# EAGLE design cyclops_r3 (EAGLE 6.5.0)
Cyclops 3.0 Schematic Cyclops R3.0 High power LED driver Linear current control Optional linear optical power control Built-in DAC Wide bandwidth Appropriate for scientific applications: e.g. fluorescent imaging and optogenetics
DESIGNER: JONATHAN P. NEWMAN; DOC_NUMBER: N/A; REVISION: 3.1

## Sheet 1 of 4: I/O Interface
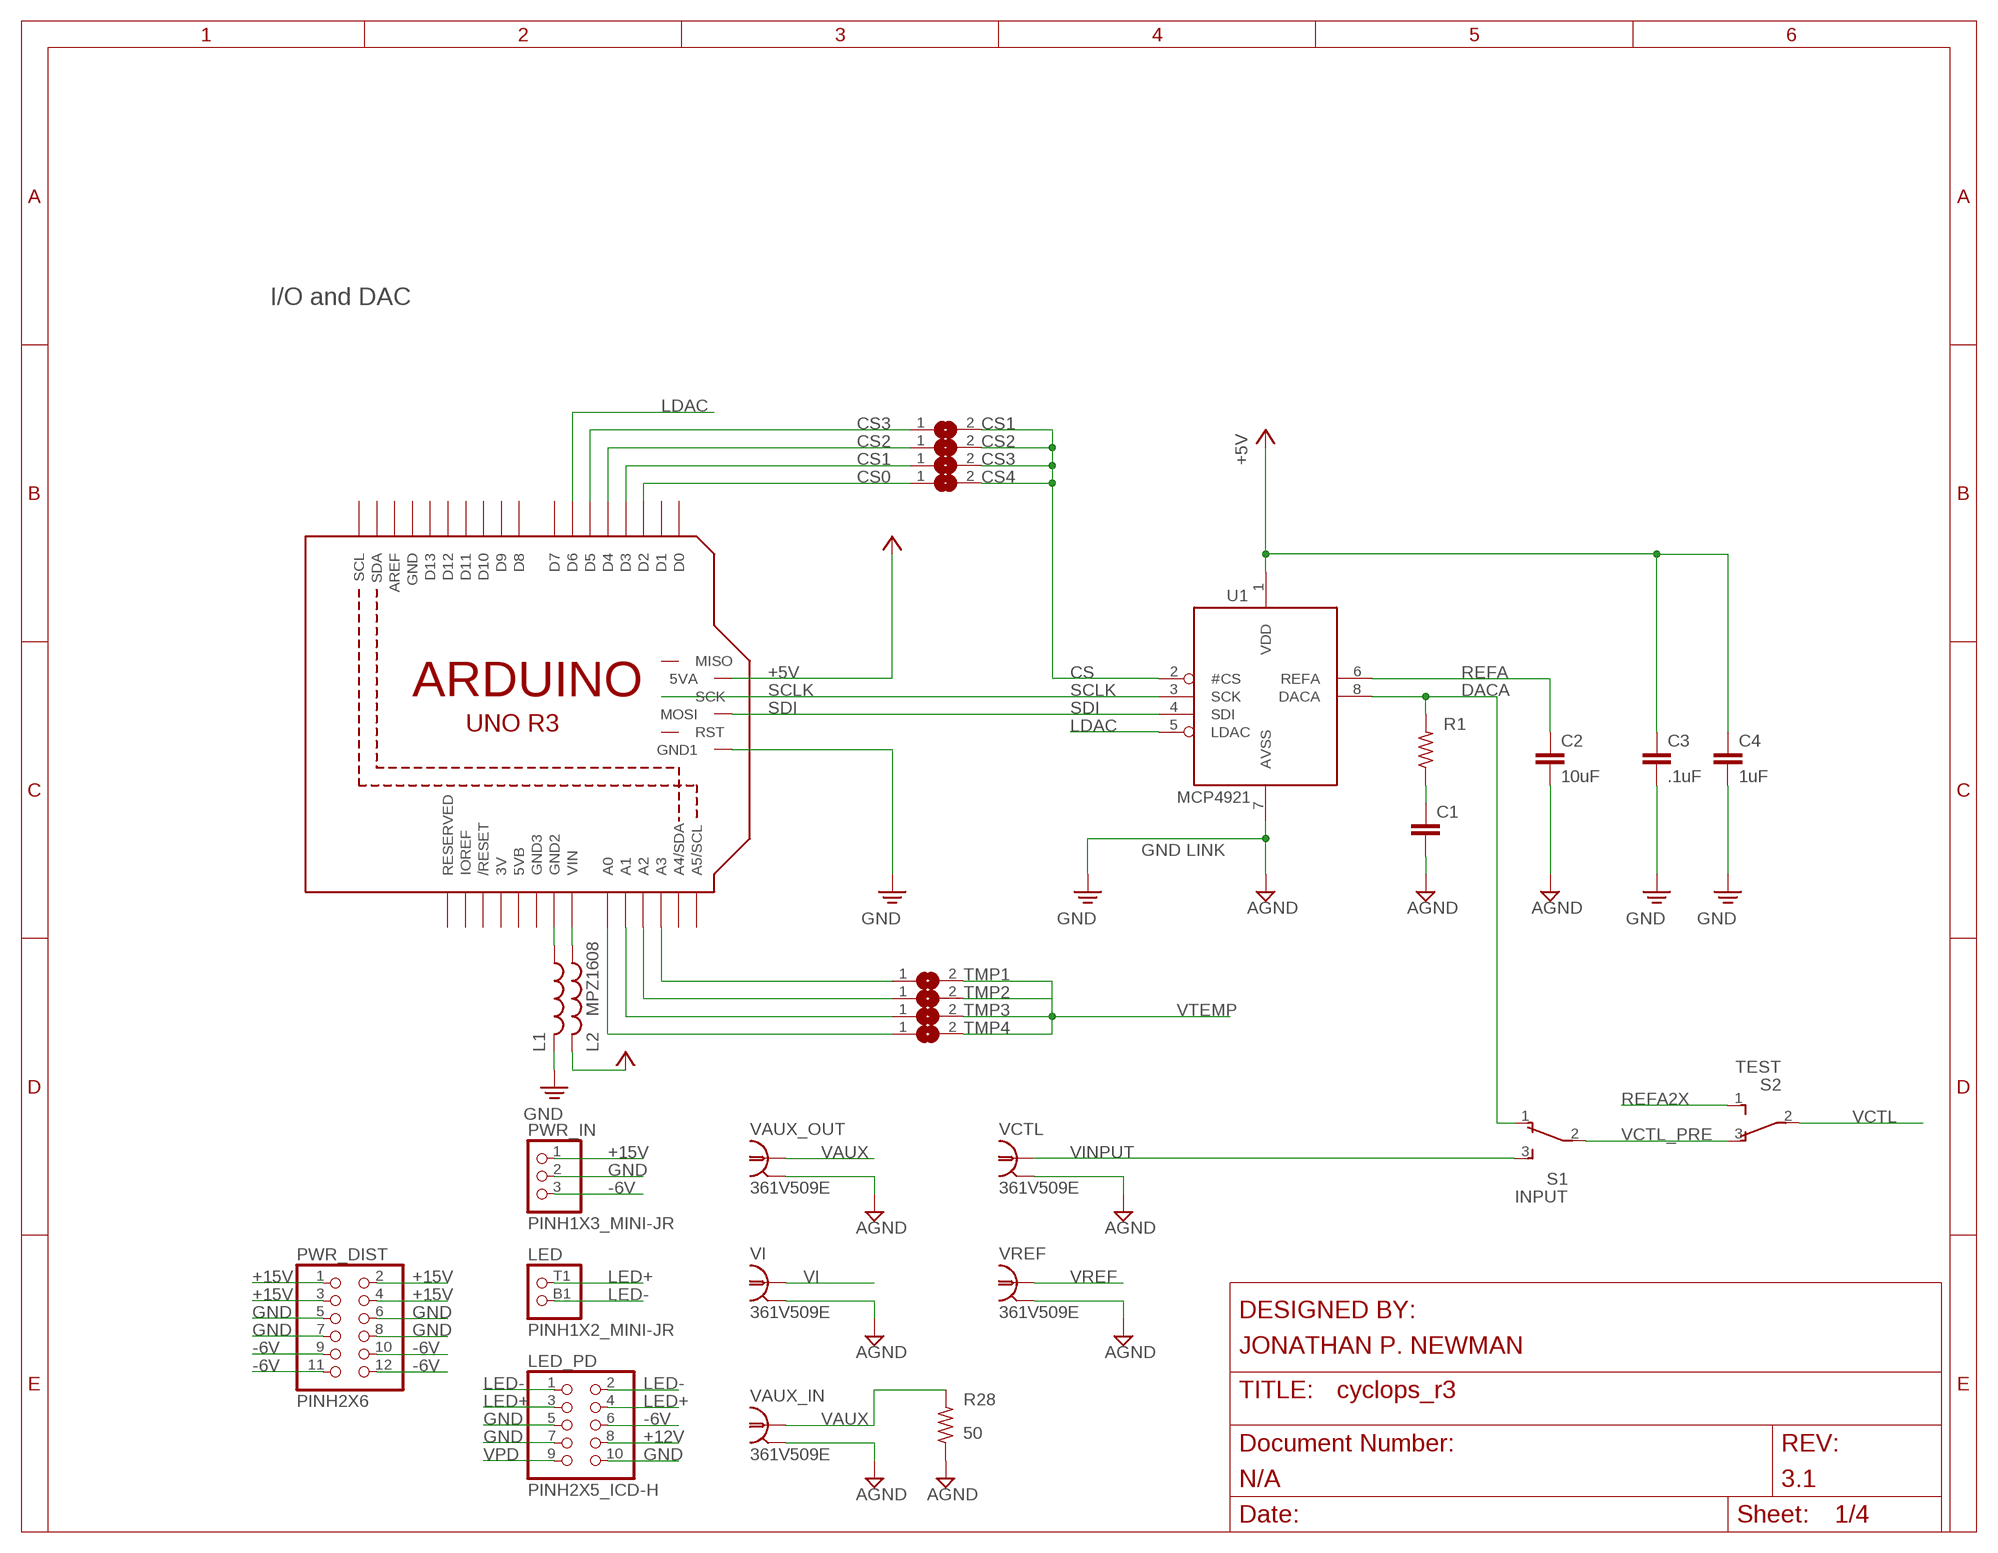
[diagram p0: schematic, sheet 1]

### Parts
ARDUNIO  ARDUINO_R3_ICSP_PINS  [ARUDINOR3_PINS]
C1  C_0603  [0603]
C2  10uF  C_0805  [0805]
C3  .1uF  C_0603  [0603]
C4  1uF  C_0805  [0805]
CS1  SJ  [SJ]
CS2  SJ  [SJ]
CS3  SJ  [SJ]
CS4  SJ  [SJ]
L1  MPZ1608  L_0805  [0805]
L2  MPZ1608  L_0805  [0805]
LED  PINH1X2_MINI-JR  [MINI-JR-2X1]
LED_PD  PINH2X5_ICD-H  [2X05-IDC]
PWR_DIST  PINH2X6  [2X06-BIG]
PWR_IN  PINH1X3_MINI-JR  [MINI-JR-1X3]
R1  R_0603  [0603]
R28  50  R_0603  [0603]
S1  INPUT  SPDT_JS  [JS102011SAQN]
S2  TEST  SPDT_CFPA  [CFPA]
TMP1  SJ  [SJ]
TMP2  SJ  [SJ]
TMP3  SJ  [SJ]
TMP4  SJ  [SJ]
U1  MCP4921  MCP4921SOIC  [SO08]
VAUX_IN  361V509E  BNC_V-BITE  [361V509E]
VAUX_OUT  361V509E  BNC_V-BITE  [361V509E]
VCTL  361V509E  BNC_V-BITE  [361V509E]
VI  361V509E  BNC_V-BITE  [361V509E]
VREF  361V509E  BNC_V-BITE  [361V509E]

### Nets
+5V: ARDUNIO.5VA C3.1 C4.1 U1.1(VDD)
+12V [pwr]: L2.2 LED_PD.8 ; supply symbol labelled +5V ; also sheet 2,3,4
+15V [pwr]: PWR_DIST.1 PWR_DIST.2 PWR_DIST.3 PWR_DIST.4 PWR_IN.1 ; also sheet 2
-6V: LED_PD.6 PWR_DIST.9 PWR_DIST.10 PWR_DIST.11 PWR_DIST.12 PWR_IN.3 ; also sheet 2
AGND: R28.1
CS: CS1.2 CS2.2 CS3.2 CS4.2 U1.2(#CS)
CS0: ARDUNIO.D2 CS4.1
CS1: ARDUNIO.D3 CS3.1
CS2: ARDUNIO.D4 CS2.1
CS3: ARDUNIO.D5 CS1.1
CS4: ARDUNIO.A0 TMP4.1
CS5: ARDUNIO.A1 TMP3.1
CS6: ARDUNIO.A3 TMP1.1
CS8: ARDUNIO.A2 TMP2.1
DACA: R1.2 S1.1 U1.8(DACA)
GND: ARDUNIO.GND1 C1.2 C2.2 C3.2 C4.2 L1.2 LED_PD.5 LED_PD.7 LED_PD.10 PWR_DIST.5 PWR_DIST.6 PWR_DIST.7 PWR_DIST.8 PWR_IN.2 U1.7(AVSS) VAUX_IN.2 VAUX_IN.3 VAUX_OUT.2 VAUX_OUT.3 VCTL.2 VCTL.3 VI.2 VI.3 VREF.2 VREF.3 ; supply symbol labelled AGND ; also sheet 2,3,4
LDAC: ARDUNIO.D6 U1.5(LDAC)
LED+: LED.T1 LED_PD.3 LED_PD.4 ; also sheet 4
LED-: LED.B1 LED_PD.1 LED_PD.2 ; also sheet 4
N$1: C1.1 R1.1
N$11: ARDUNIO.GND2 L1.1
N$14: ARDUNIO.VIN L2.1
REFA: C2.1 U1.6(REFA) ; also sheet 3,4
REFA2X: S2.1 ; also sheet 4
SCLK: ARDUNIO.SCK U1.3(SCK)
SDI: ARDUNIO.MOSI U1.4(SDI)
VAUX: R28.2 VAUX_IN.1 VAUX_OUT.1 ; also sheet 4
VCTL: S2.2 ; also sheet 4
VCTL_PRE: S1.2 S2.3
VI: VI.1 ; also sheet 2,4
VINPUT: S1.3 VCTL.1
VPD: LED_PD.9
VREF: VREF.1 ; also sheet 4
VTEMP: TMP1.2 TMP2.2 TMP3.2 TMP4.2 ; also sheet 3
Unconnected: ARDUNIO.3V ARDUNIO.5VB ARDUNIO.A4(A4/SDA) ARDUNIO.A5(A5/SCL) ARDUNIO.AREF ARDUNIO.D0 ARDUNIO.D1 ARDUNIO.D7 ARDUNIO.D8 ARDUNIO.D9 ARDUNIO.D10 ARDUNIO.D11 ARDUNIO.D12 ARDUNIO.D13 ARDUNIO.GND ARDUNIO.GND3 ARDUNIO.IOREF ARDUNIO.MISO ARDUNIO.RESERVED ARDUNIO.RESET$1(RST) ARDUNIO.RESET(/RESET) ARDUNIO.SCL ARDUNIO.SDA

### Notes on the sheet
- I/O and DAC
- GND LINK

## Sheet 2 of 4: Power
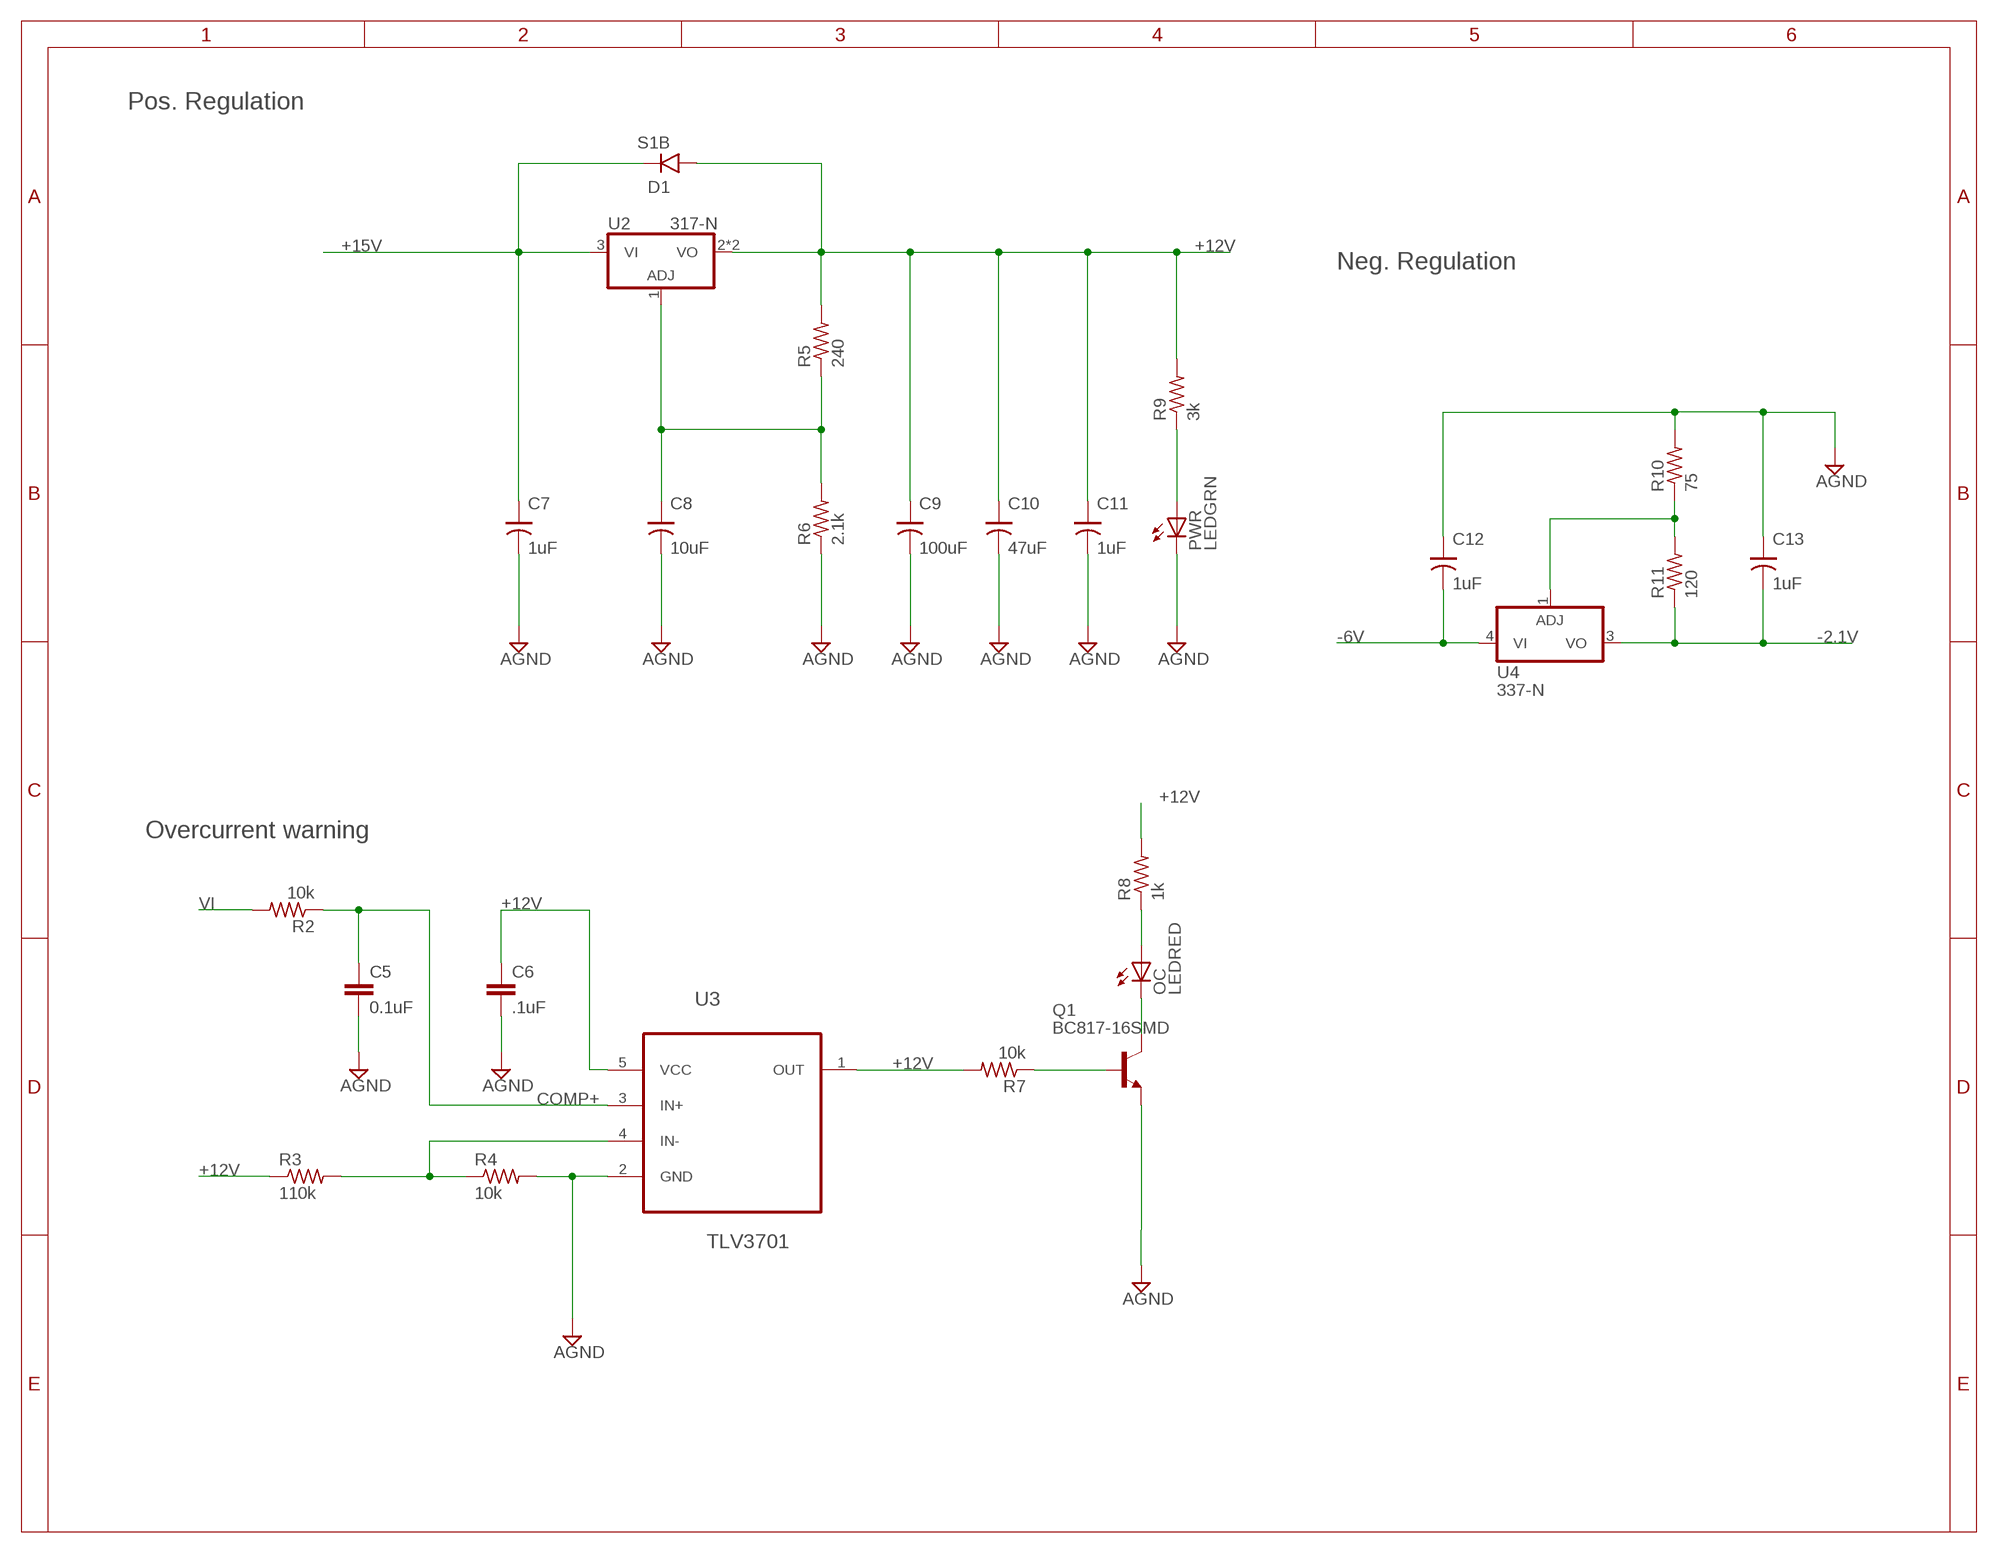
[diagram p1: schematic, sheet 2]

### Parts
C5  0.1uF  C_0603  [0603]
C6  .1uF  C_0603  [0603]
C7  1uF  C-POL_1206  [1206-POL]
C8  10uF  C-POL_1206  [1206-POL]
C9  100uF  C-POL_0807  [153CLV-0807]
C10  47uF  C-POL_0807  [153CLV-0807]
C11  1uF  C-POL_1206  [1206-POL]
C12  1uF  C-POL_1206  [1206-POL]
C13  1uF  C-POL_1206  [1206-POL]
D1  S1B  DIODES1B-13-F  [SMA-DO214AC]
OC  LEDRED  LED_0603  [LED-0603]
PWR  LEDGRN  LED_0603  [LED-0603]
Q1  BC817-16SMD  [SOT23-BEC]
R2  10k  R_0603  [0603]
R3  110k  R_0603  [0603]
R4  10k  R_0603  [0603]
R5  240  R_0603  [0603]
R6  2.1k  R_0603  [0603]
R7  10k  R_0603  [0603]
R8  1k  R_0603  [0603]
R9  3k  R_0603  [0603]
R10  75  R_0603  [0603]
R11  120  R_0603  [0603]
U2  317-N  317_TO263  [TO-263]
U3  TLV3701  TLV3701CDBVT  [SOT95P280X145-5N]
U4  337-N  337IMP  [SOT223]

### Nets
+12V [pwr]: C6.1 C9.+ C10.+ C11.+ D1.A R3.1 R5.2 R8.2 R9.2 U2.2(VO) U2.4(VO) U3.5(VCC) ; also sheet 1,3,4
+15V [pwr]: C7.+ D1.C U2.3(VI) ; also sheet 1
-2.1V: C13.- R11.1 U4.3(VO) ; also sheet 4
-6V: C12.- U4.4(VI) ; also sheet 1
COMP+: C5.1 R2.1 U3.3(IN+)
GND: C5.2 C6.2 C7.- C8.- C9.- C10.- C11.- C12.+ C13.+ PWR.C Q1.E R4.2 R6.1 R10.2 U3.2(GND) ; supply symbol labelled AGND ; also sheet 1,3,4
N$2: OC.A R8.1
N$3: PWR.A R9.1
N$5: R3.2 R4.1 U3.4(IN-)
N$9: OC.C Q1.C
N$12: R10.1 R11.2 U4.1(ADJ)
N$27: R7.2 U3.1(OUT)
N$28: Q1.B R7.1
N$72: C8.+ R5.1 R6.2 U2.1(ADJ)
VI: R2.2 ; also sheet 1,4

### Notes on the sheet
- Pos. Regulation
- Neg. Regulation
- Overcurrent warning

## Sheet 3 of 4: VREF
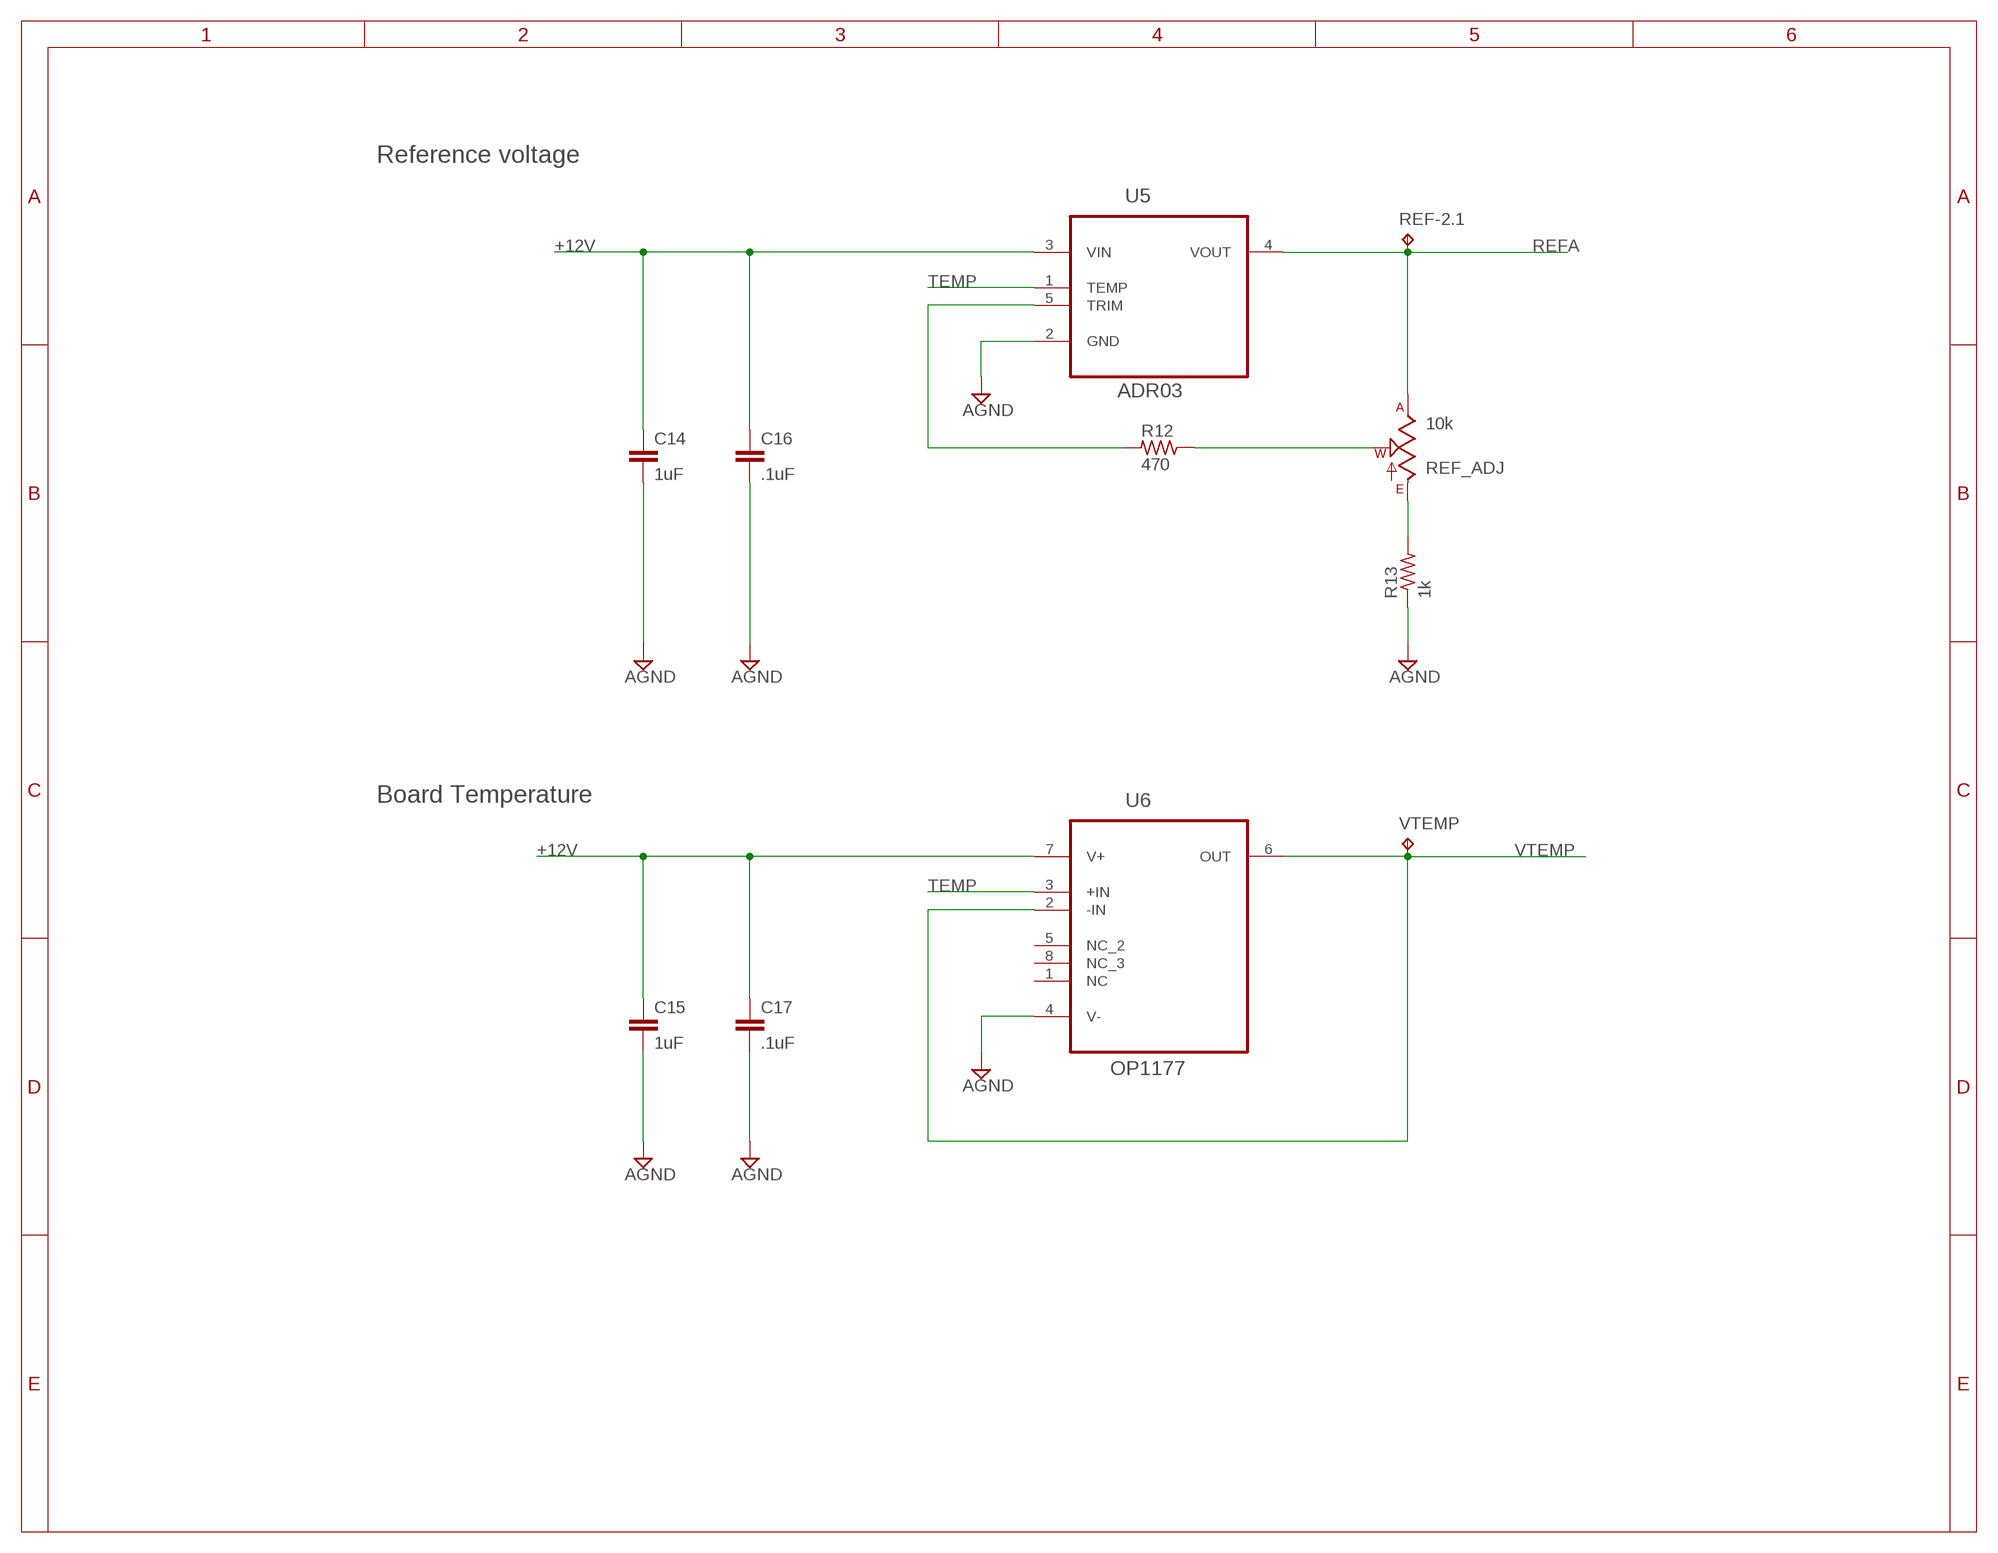
[diagram p2: schematic, sheet 3]

### Parts
C14  1uF  C_0805  [0805]
C15  1uF  C_0805  [0805]
C16  .1uF  C_0603  [0603]
C17  .1uF  C_0603  [0603]
R12  470  R_0603  [0603]
R13  1k  R_0603  [0603]
REF-2.1  TPTP08R  [TP08R]
REF_ADJ  10k  TRIM_US-SM-42/43W  [SM-42/43W]
U5  ADR03  ADR03AKSZ-REEL7  [SOT65P210X110-5N]
U6  OP1177  OP1177ARMZ  [SOP65P490X110-8N]
VTEMP  TPTP08R  [TP08R]

### Nets
+12V [pwr]: C14.1 C15.1 C16.1 C17.1 U5.3(VIN) U6.7(V+) ; also sheet 1,2,4
GND: C14.2 C15.2 C16.2 C17.2 R13.1 U5.2(GND) U6.4(V-) ; supply symbol labelled AGND ; also sheet 1,2,4
N$6: R13.2 REF_ADJ.3(E)
N$20: R12.2 U5.5(TRIM)
N$22: R12.1 REF_ADJ.2(W)
REFA: REF-2.1.TP REF_ADJ.1(A) U5.4(VOUT) ; also sheet 1,4
TEMP: U5.1(TEMP) U6.3(+IN)
VTEMP: U6.2(-IN) U6.6(OUT) VTEMP.TP ; also sheet 1
Unconnected: U6.1(NC) U6.5(NC_2) U6.8(NC_3)

### Notes on the sheet
- Reference voltage
- Board Temperature

## Sheet 4 of 4: Driver
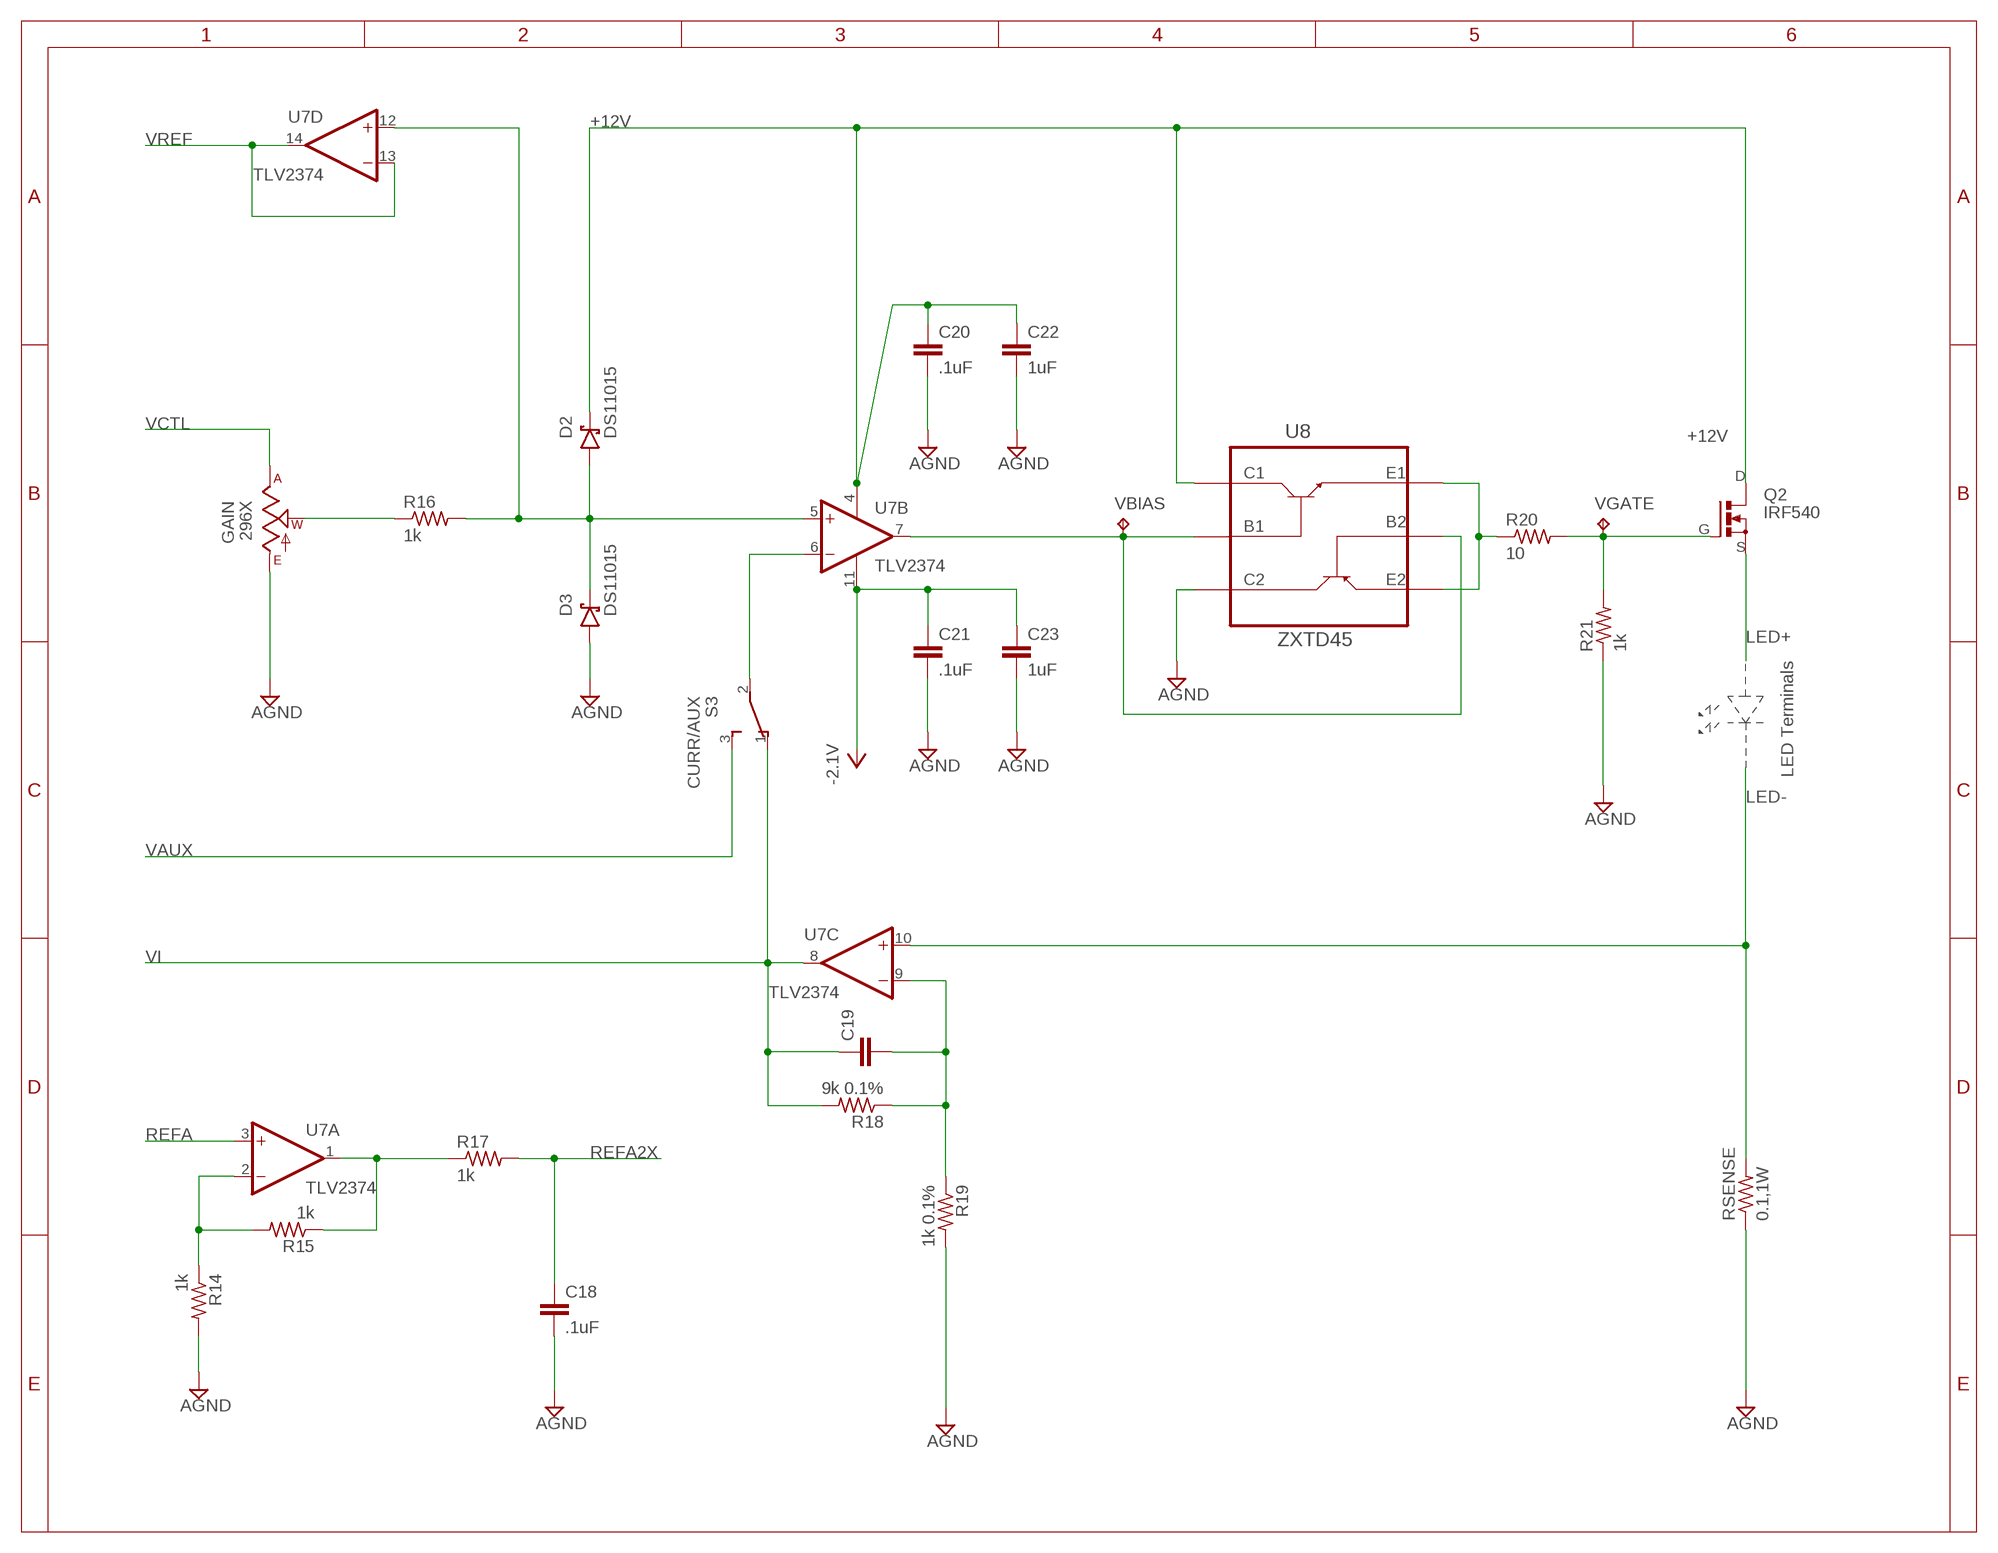
[diagram p3: schematic, sheet 4]

### Parts
C18  .1uF  C_0603  [0603]
C19  C_0603  [0603]
C20  .1uF  C_0603  [0603]
C21  .1uF  C_0603  [0603]
C22  1uF  C_0805  [0805]
C23  1uF  C_0805  [0805]
D2  DS11015  S-DIODESOD-123  [SOD123]
D3  DS11015  S-DIODESOD-123  [SOD123]
GAIN  296X  POT_US_296X  [296X-POT]
Q2  IRF540  N-MOSFETTO-262  [TO-262_01]
R14  1k  R_0603  [0603]
R15  1k  R_0603  [0603]
R16  1k  R_0603  [0603]
R17  1k  R_0603  [0603]
R18  9k 0.1%  R_0603  [0603]
R19  1k 0.1%  R_0603  [0603]
R20  10  R_0603  [0603]
R21  1k  R_0603  [0603]
RSENSE  0.1,1W  R_2512W  [2512W]
S3  CURR/AUX  SPDT_JS  [JS102011SAQN]
U7  TLV2374  QUAD-OPAMP_14PIND  [SO14]
U8  ZXTD45  ZXTD4591E6  [SOT23-6]
VBIAS  TPTP08R  [TP08R]
VGATE  TPTP08R  [TP08R]

### Nets
+12V [pwr]: C20.1 C22.1 D2.C Q2.D U7.4(P:V+) U8.1(C1) ; also sheet 1,2,3
-2.1V: C21.1 C23.1 U7.11(P:V-) ; also sheet 2
_VREF: D2.A D3.C R16.2 U7.5(B:+IN) U7.12(D:+IN)
GND: C18.2 C20.2 C21.2 C22.2 C23.2 D3.A GAIN.E R14.2 R19.2 R21.1 RSENSE.1 U8.3(C2) ; supply symbol labelled AGND ; also sheet 1,2,3
LED+: Q2.S ; also sheet 1
LED-: RSENSE.2 U7.10(C:+IN) ; also sheet 1
N$4: U7.7(B:OUT) U8.2(B1) U8.5(B2) VBIAS.TP
N$7: GAIN.W R16.1
N$8: R14.1 R15.2 U7.2(A:-IN)
N$10: R20.1 U8.4(E2) U8.6(E1)
N$13: Q2.G R20.2 R21.2 VGATE.TP
N$15: C19.2 R18.1 R19.1 U7.9(C:-IN)
REFA: U7.3(A:+IN) ; also sheet 1,3
REFA2X: C18.1 R17.2 ; also sheet 1
VAUX: S3.3 ; also sheet 1
VCTL: GAIN.A ; also sheet 1
VFB: S3.2 U7.6(B:-IN)
VI: C19.1 R18.2 S3.1 U7.8(C:OUT) ; also sheet 1,2
VREF: U7.13(D:-IN) U7.14(D:OUT) ; also sheet 1
VREFA2X: R15.1 R17.1 U7.1(A:OUT)

### Notes on the sheet
- LED Terminals

## Library data of the parts
ARDUNIO = cyclops:ARDUINO_R3_ICSP: Arduino UNO R3 Sheild with ICSP
C1 C3 C5 C6 C16-C21 = cyclops:C: Capacitor
C2 C4 C14 C15 C22 C23 = cyclops:C: Capacitor; MN: TDK Corp.; PARTNO: C2012X5R1Cxxxxxxx; VID: DK
C7-C13 = cyclops:C-POL: Polarized Capacitor
CS1-CS4 TMP1-TMP4 = cyclops:SJ: SMD solder JUMPER
D1 = cyclops:DIODE: DIODE
D2 D3 = cyclops:S-DIODE: Schottky Diode
GAIN = cyclops:POT_US
L1 L2 = cyclops:L: Inductor
LED = cyclops:PINH1X2
LED_PD = cyclops:PINH2X5
OC PWR = cyclops:LED: Surface mount LED
PWR_DIST = cyclops:PINH2X6
PWR_IN = cyclops:PINH1X3
Q1 = cyclops:BC817*: NPN Transistor
Q2 = cyclops:N-MOSFET: N-CHANNEL MOS FET SYMBOL
R1-R21 R28 = cyclops:R: Resistor; DK: PxxxxHTR-ND; MN: Panasonic; MPN: ERJ-3EKFxxxxV
REF-2.1 VBIAS VGATE VTEMP = cyclops:TP: Test pad
REF_ADJ = cyclops:TRIM_US-: POTENTIOMETER
RSENSE = cyclops:R: Resistor
S1-S3 = cyclops:SPDT: SPDT Switch
U1 = cyclops:MCP4921: 12-bit DAC with SPI interface Microchip Technoligies
U2 = cyclops:*317: Positive VOLTAGE REGULATOR
U3 = ti-extended:TLV3701CDBVT: FAMILY OF NANOPOWER PUSH-PULL OUTPUT COMPARATORS; MPN: TLV3701CDBVT; OC_FARNELL: 8455538; OC_NEWARK: 76C8790; PACKAGE: SOT-23-5; SUPPLIER: Texas Instruments
U4 = cyclops:*337: Negative VOLTAGE REGULATOR
U5 = cyclops:ADR03AKSZ-REEL7: Ultracompact, Precision 10.0 V/5.0 V/2.5 V/3.0 V Voltage References; MPN: ADR03AKSZ-REEL7; OC_FARNELL: 1838919; OC_NEWARK: 59K2675; PACKAGE: SC70-5; SUPPLIER: Analog Devices
U6 = cyclops:OP1177ARMZ: Bias Current Operational Amplifiers; MPN: OP1177ARMZ; OC_FARNELL: 2074880; OC_NEWARK: 22P9695; PACKAGE: MSOP-8; SUPPLIER: Analog Devices
U7 = cyclops:QUAD-OPAMP_14PIN: OP AMP
U8 = cyclops:ZXTD4591E6: NPN/PNP Gate Driver
VAUX_IN VAUX_OUT VCTL VI VREF = cyclops:BNC: BNC CONNECTOR M/A COM www.macom.com distributor Farnell 149-452

## Board
Cyclops 3.0 PCB Cyclops R3.0 High power LED driver Linear current control Optional linear optical power control Built-in DAC Wide bandwidth Appropriate for scientific applications: e.g. fluorescent imaging and optogenetics
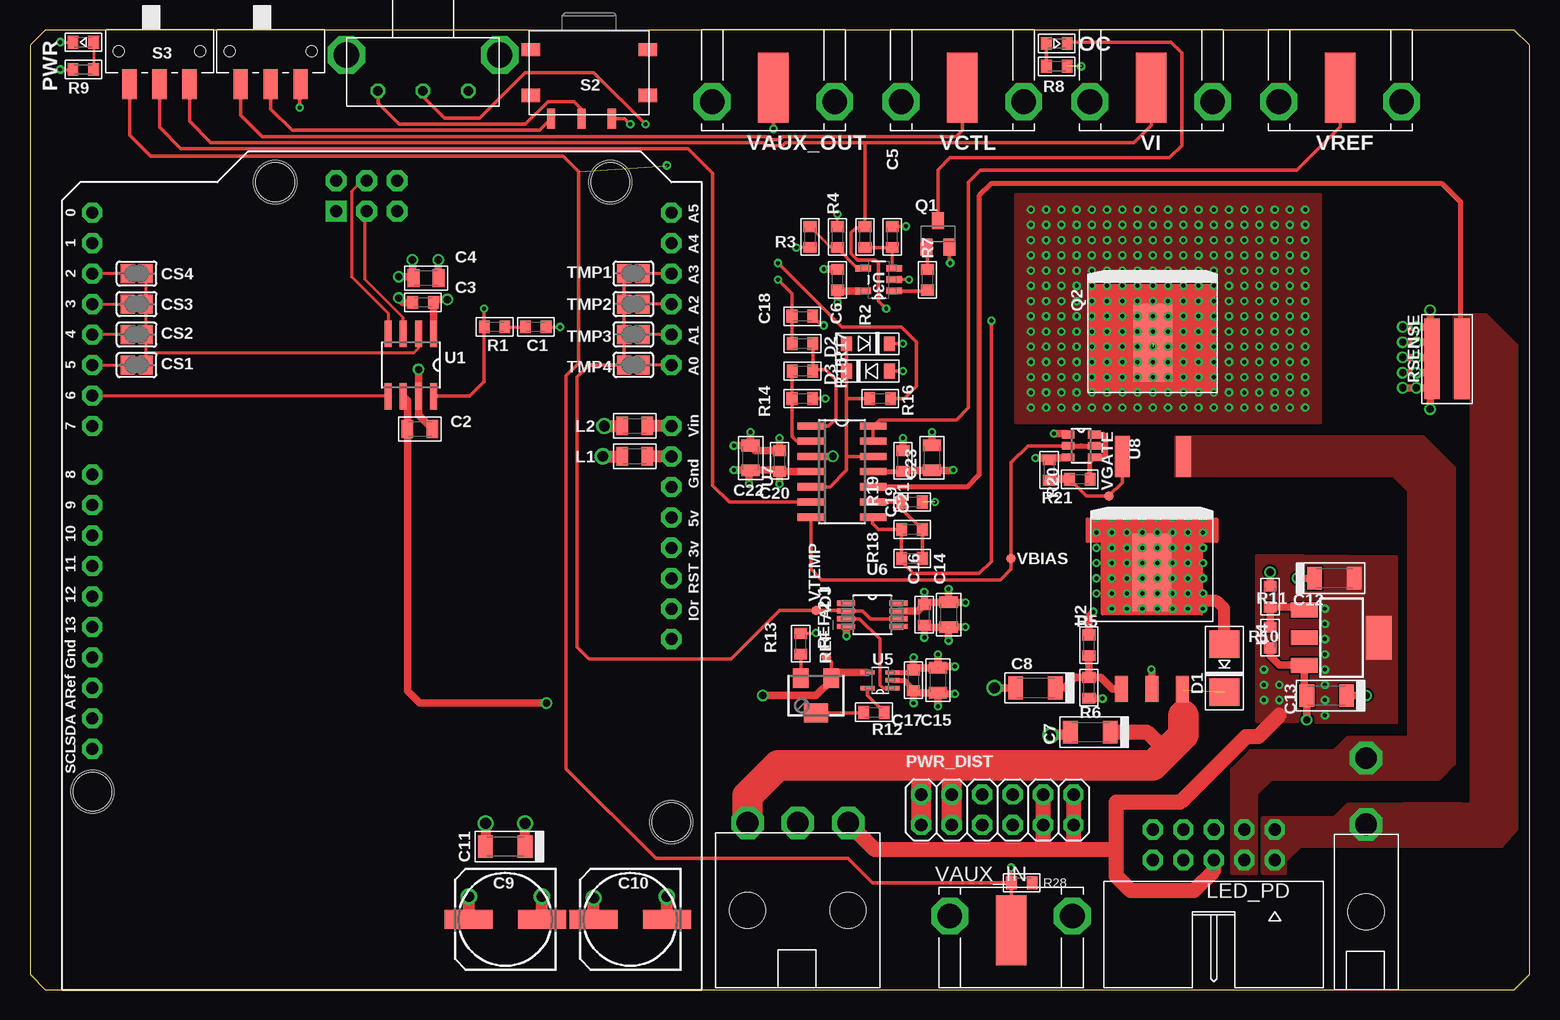
[diagram p4: board, top side]
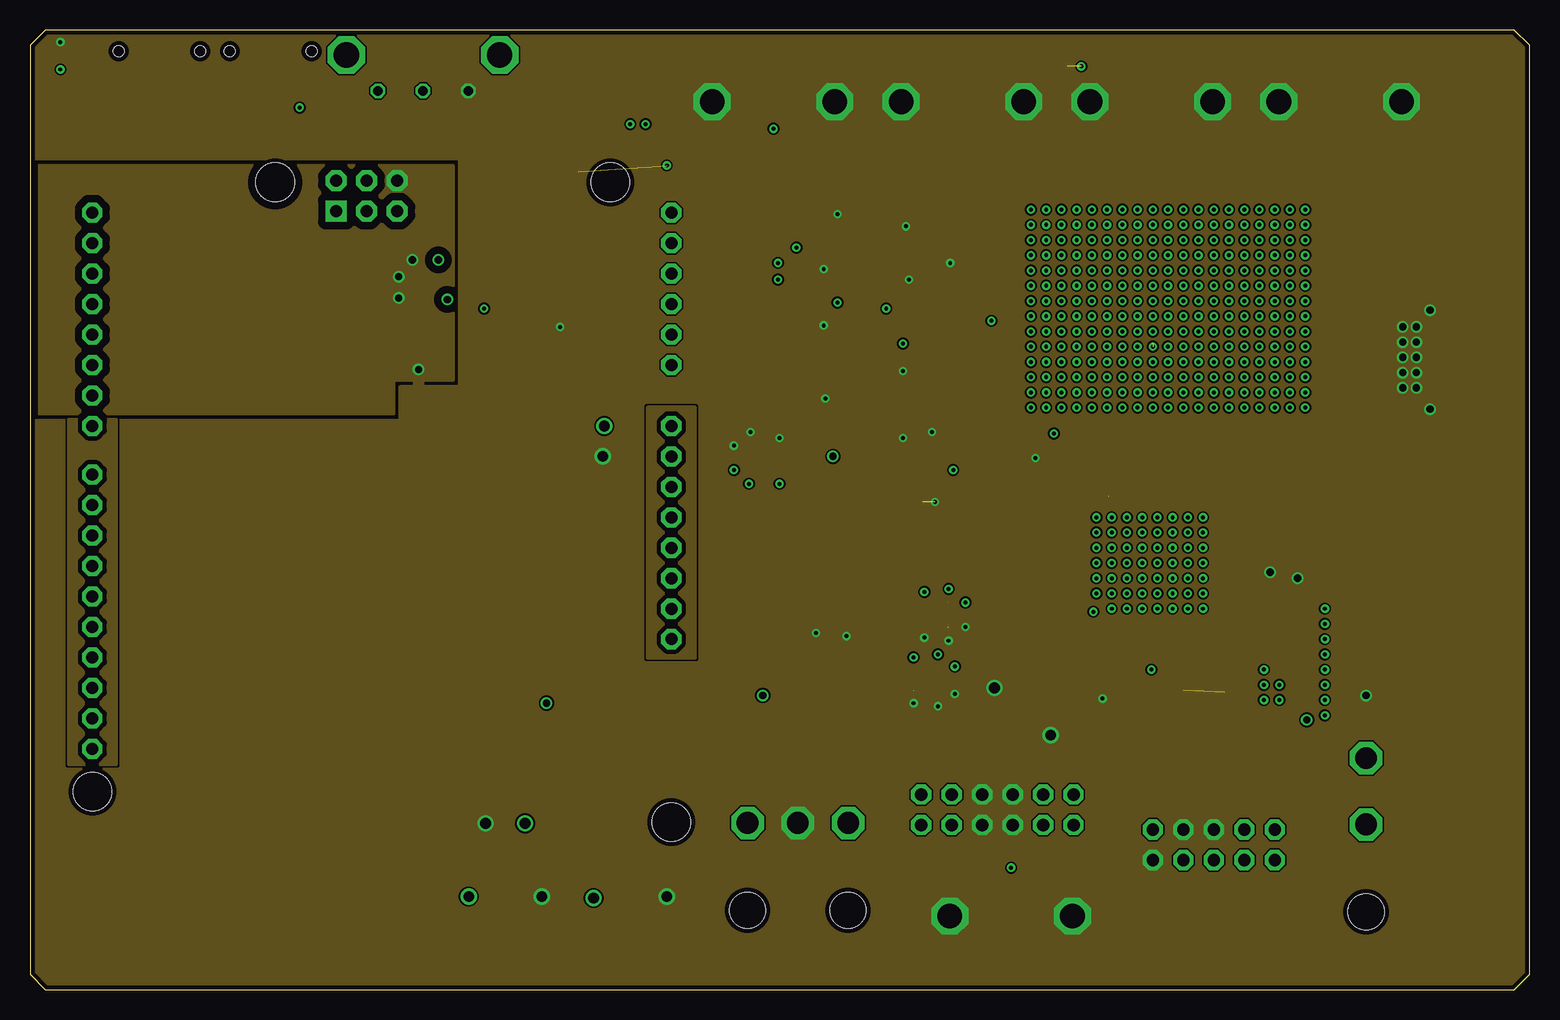
[diagram p5: board, inner layer Route2]
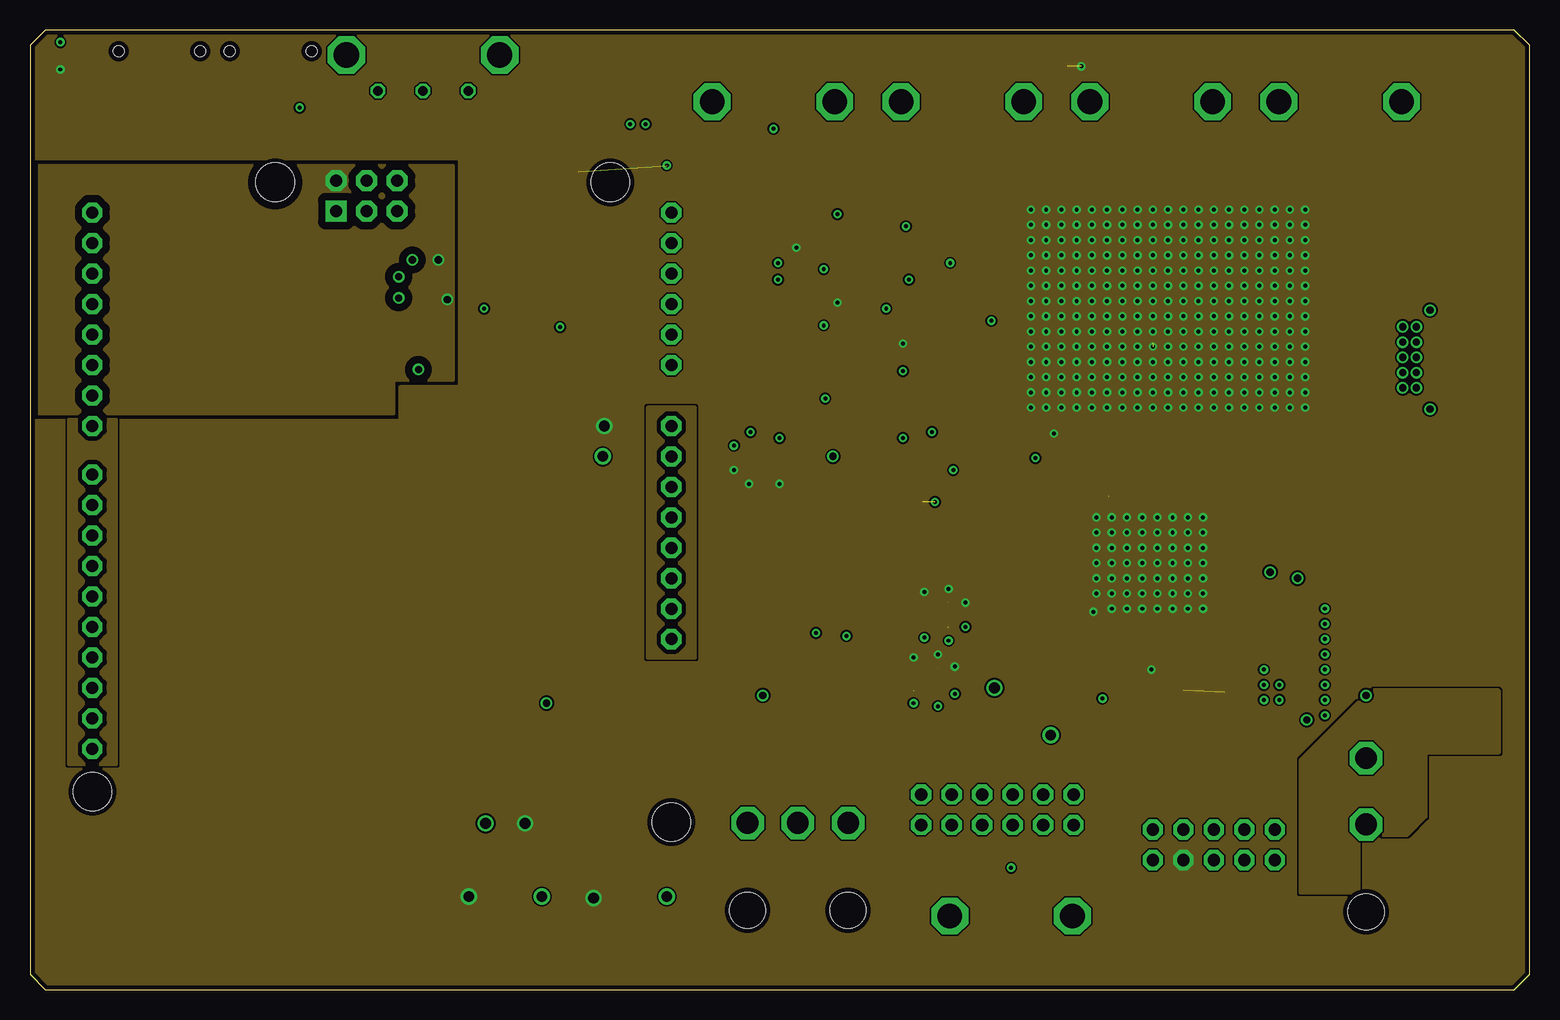
[diagram p6: board, inner layer Route15]
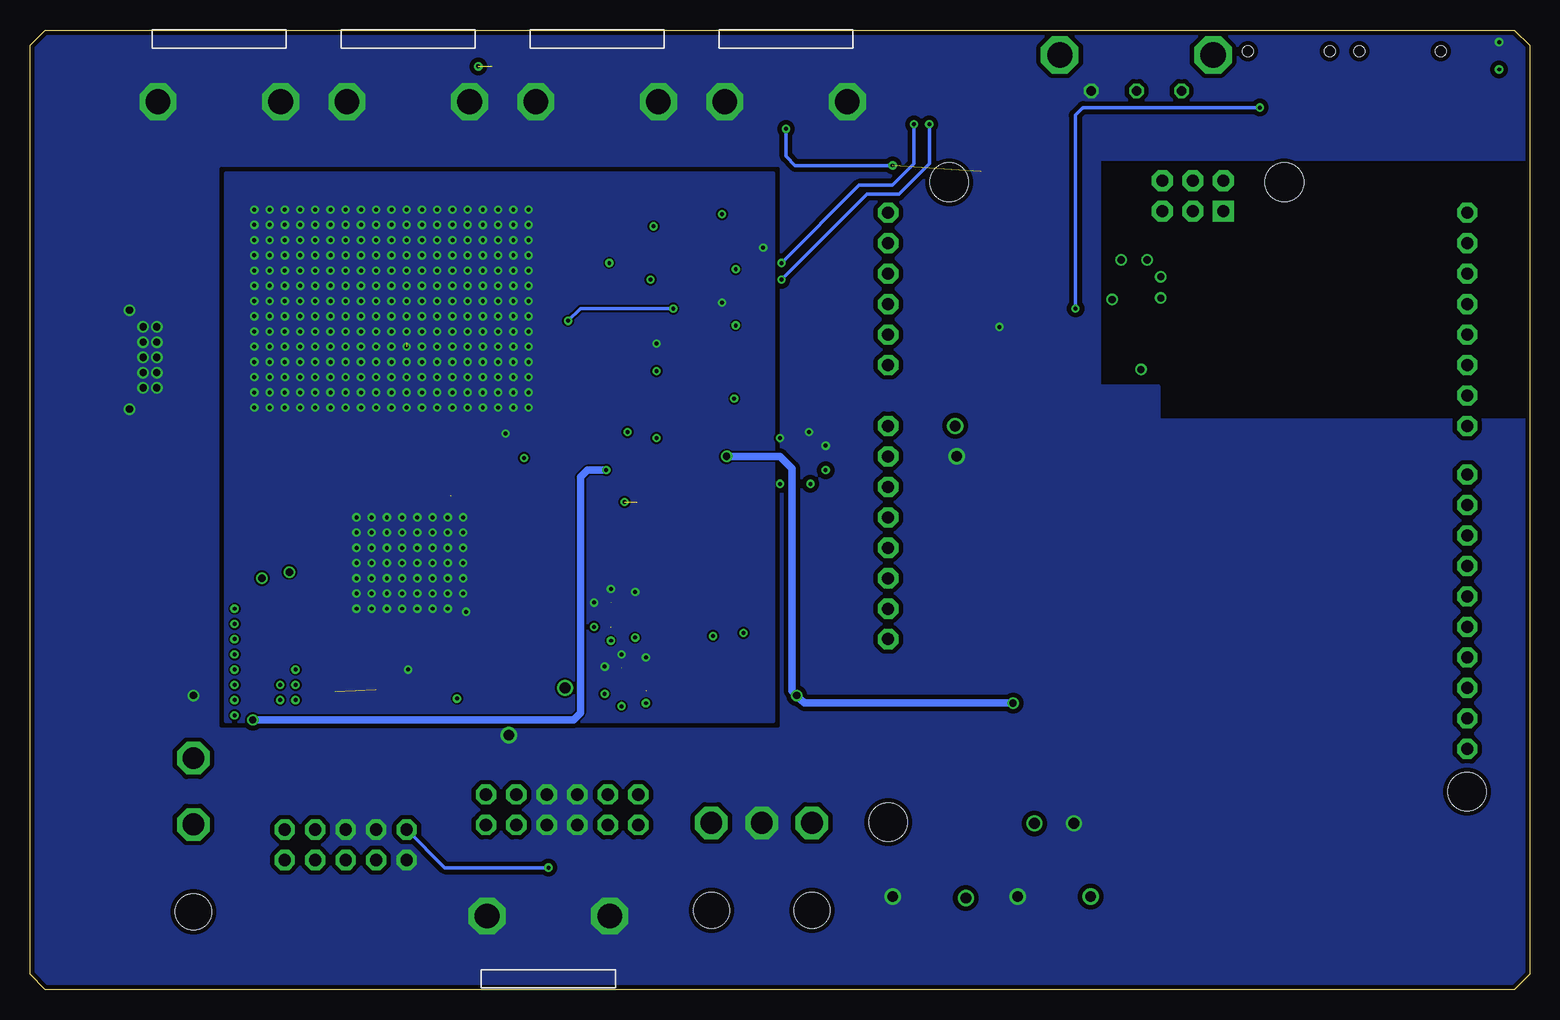
[diagram p7: board, bottom side, seen from below]

Size 125 x 80 mm. Coordinates in mm from the lower left corner, seen from the top.
Outline: 0,78.73 0,1.27 1.27,0 123.73,0 125,1.27 125,78.73 123.73,80 1.27,80 0,78.73
Copper layers (1+2*15+16): Top 0.0356mm / dielectric 1.5011mm / Route2 0.0356mm / dielectric 0.1499mm / Route15 0.0356mm / dielectric 0.2007mm / Bottom 0.0356mm
Design rules "ohs-park-mod-4layer_tented-vias": minimum track width 6mil, minimum drill 13mil, track to track 6mil, track to pad 6mil, pad to pad 6mil, via to via 6mil, smd to smd 6mil, copper to edge 15mil, drill to drill 6mil, minimum pad ring 7mil, minimum via ring 7mil, stop-mask expansion 4mil, vias tented up to drill 100mil, thermal gap 10mil
tKeepout: area 0,0 to 2.5,80; area 122.4,0 to 125,80
bKeepout: area 0,0 to 2.5,80; area 122.4,0 to 125,80; area 63,22.4 to 108.7,68.1

### Footprints (pad centres in the part's own frame; a part is rotated, then mirrored left to right if it is on the bottom)
ARUDINOR3_PINS = drill 1 pad 1.676 octagon: 3V 36.83,2.54; 5VB 39.37,2.54; A0 52.07,2.54; A1 54.61,2.54; A2 57.15,2.54; A3 59.69,2.54; A4 62.23,2.54; A5 64.77,2.54; AREF 25.146,50.8; D0 64.77,50.8; D1 62.23,50.8; D2 59.69,50.8; D3 57.15,50.8; D4 54.61,50.8; D5 52.07,50.8; D6 49.53,50.8; D7 46.99,50.8; D8 42.926,50.8; D9 40.386,50.8; D10 37.846,50.8; D11 35.306,50.8; D12 32.766,50.8; D13 30.226,50.8; GND 27.686,50.8; GND2 44.45,2.54; GND3 41.91,2.54; IOREF 31.75,2.54; RESERVED 29.21,2.54; RESET 34.29,2.54; SCL 20.066,50.8; SDA 22.606,50.8; VIN 46.99,2.54 | drill 1 pad 1.778 octagon: 5VA 67.437,30.48; GND1 67.437,25.4; MOSI 67.437,27.94; RESET$1 64.897,25.4; SCK 64.897,27.94 | drill 1 pad 1.778 square: MISO 64.897,30.48 | hole 3.2: 16.51,50.8; 67.31,35.56; 67.31,7.62; 13.97,2.54
0603 = smd 0.889 x 1.067: 1 -0.864,0; 2 0.864,0
0805 = smd 0.965 x 1.524: 1 -1.041,0; 2 1.041,0
1206-POL = smd 1.219 x 1.88: + -1.651,0; - 1.651,0
153CLV-0807 = smd 4 x 1.6: + 3.05,0; - -3.05,0
SJ = smd 1.168 x 1.6: 1 -0.762,0; 2 0.762,0
SMA-DO214AC = smd 2.3 x 2.5: A -2,0; C 2,0
SOD123 = smd 0.914 x 1.219: A -1.8,0; C 1.8,0
296X-POT = drill 0.8 octagon: A -3.759,0; E 3.759,0; W 0,0 | drill 2.108 octagon: M1 -6.388,2.997; M2 6.388,2.997
MINI-JR-2X1 = drill 1.803 octagon: B1 0.127,13.767; T1 0.127,19.279 | hole 2.997: 0.127,6.477
2X05-IDC = drill 1.016 pad 1.676 octagon: 1 -5.08,-2.54; 2 -5.08,0; 3 -2.54,-2.54; 4 -2.54,0; 5 0,-2.54; 6 0,0; 7 2.54,-2.54; 8 2.54,0; 9 5.08,-2.54; 10 5.08,0
LED-0603 = smd 1.067 x 0.889: A 0,0.406; C 0,2.134
2X06-BIG = drill 1.016 pad 1.676 octagon: 1 0,0; 2 0,2.54; 3 2.54,0; 4 2.54,2.54; 5 5.08,0; 6 5.08,2.54; 7 7.62,0; 8 7.62,2.54; 9 10.16,0; 10 10.16,2.54; 11 12.7,0; 12 12.7,2.54
MINI-JR-1X3 = drill 1.803 octagon: 1 0,7.29; 2 4.191,7.29; 3 8.382,7.29 | hole 2.997: 0,0; 8.382,0
SOT23-BEC = smd 1 x 1.4: B -0.95,-1.1; C 0,1.1; E 0.95,-1.1
TO-262_01 = smd 3.251 x 6.452: D 0,4.128 | smd 1.27 x 3.429: G -2.54,-5.347; S 2.54,-5.347
TP08R = smd 0.8 x 0.8: TP 0,0
SM-42/43W = smd 1.3 x 1.6: 1 -1.27,-1.45; 3 1.27,-1.45 | smd 2 x 1.6: 2 0,1.45
2512W = smd 6.7 x 1.3: 1 0,-1.25; 2 0,1.25
JS102011SAQN = smd 1.2 x 2.5: 1 -2.5,2.75; 2 0,2.75; 3 2.5,2.75 | hole 0.9: -3.4,0; 3.4,0
CFPA = smd 1.7 x 0.7: 1 3.85,1.9; 2 3.85,-0.64; 3 3.85,-3.18 | smd 1.1 x 1.55: NC1 -1.905,4.875; NC2 -1.905,-4.875; NC3 1.905,-4.875; NC4 1.905,4.875
SO08 = smd 0.6 x 2.2: 1 -1.905,-2.6; 2 -0.635,-2.6; 3 0.635,-2.6; 4 1.905,-2.6; 5 1.905,2.6; 6 0.635,2.6; 7 -0.635,2.6; 8 -1.905,2.6
TO-263 = smd 1.067 x 2.159: 1 -2.54,-7.188; 2 0,-7.188; 3 2.54,-7.188 | smd 3.251 x 6.452: 4 0,2.54
SOT95P280X145-5N = smd 1.27 x 0.559: 1 -1.295,0.94; 2 -1.295,0; 3 -1.295,-0.94; 4 1.295,-0.94; 5 1.295,0.94
SOT223 = smd 1.219 x 2.235: 1 -2.311,-3.099; 2 0,-3.099; 3 2.311,-3.099 | smd 3.6 x 2.2: 4 0,3.099
SOT65P210X110-5N = smd 1.168 x 0.356: 1 -1.041,0.66; 2 -1.041,0; 3 -1.041,-0.66; 4 1.041,-0.66; 5 1.041,0.66
SOP65P490X110-8N = smd 1.499 x 0.432: 1 -2.184,0.965; 2 -2.184,0.33; 3 -2.184,-0.33; 4 -2.184,-0.965; 5 2.184,-0.965; 6 2.184,-0.33; 7 2.184,0.33; 8 2.184,0.965
SO14 = smd 0.6 x 2.2: 1 -3.81,-2.6; 2 -2.54,-2.6; 3 -1.27,-2.6; 4 0,-2.6; 5 1.27,-2.6; 6 2.54,-2.6; 7 3.81,-2.6; 8 3.81,2.6; 9 2.54,2.6; 10 1.27,2.6; 11 0,2.6; 12 -1.27,2.6; 13 -2.54,2.6; 14 -3.81,2.6
SOT23-6 = smd 0.65 x 1.06: 1 -0.95,-1.1; 2 0,-1.1; 3 0.95,-1.1; 4 0.95,1.1; 5 0,1.1; 6 -0.95,1.1
361V509E = smd 2.54 x 5.842: 1 0,4.826 | drill 2.057 octagon: 2 -5.112,5.994; 3 5.112,5.994

### Placement (x,y rotation side)
ARDUNIO  56,0 90 top
C1  42.16,55.24 0 top
C2  32.51,46.73 0 top
C3  32.77,57.28 180 top
C4  33.02,59.32 180 top
C5  71.88,62.74 90 top
C6  67.31,59.18 90 top
C7  88.39,21.46 180 top
C8  83.83,25.15 180 top
C9  39.62,5.85 180 top
C10  50.04,5.85 180 top
C11  39.62,11.93 180 top
C12  108.72,34.29 0 top
C13  108.08,24.51 180 top
C14  76.57,31.24 270 top
C15  75.69,25.78 270 top
C16  74.54,31.24 270 top
C17  73.65,25.78 270 top
C18  64.38,56.13 0 top
C19  73.53,38.35 0 top
C20  62.48,44.07 90 top
C21  72.77,44.07 90 top
C22  60.07,44.32 90 top
C23  75.18,44.32 90 top
CS1  8.89,52.07 0 top
CS2  8.89,54.61 0 top
CS3  8.89,57.15 0 top
CS4  8.89,59.69 0 top
D1  99.56,26.8 270 top
D2  69.86,53.85 0 top
D3  69.86,51.56 180 top
GAIN  32.77,74.93 0 top
L1  50.42,44.45 180 top
L2  50.42,46.99 180 top
LED  111.25,0 0 top
LED_PD  98.68,10.79 180 top
OC  84.33,78.87 270 top
PWR  5.71,78.99 90 top
PWR_DIST  74.3,13.72 0 top
PWR_IN  59.82,6.6 0 top
Q1  75.69,63 0 top
Q2  93.6,49.78 0 top
R1  38.73,55.24 180 top
R2  69.6,62.74 90 top
R3  65.02,62.74 90 top
R4  67.31,62.74 90 top
R5  88.27,28.7 90 top
R6  88.27,25.15 90 top
R7  74.81,59.18 270 top
R8  85.6,76.97 0 top
R9  4.45,76.7 180 top
R10  103.38,32.77 90 top
R11  103.38,29.34 90 top
R12  70.35,23.11 0 top
R13  64.25,28.83 270 top
R14  64.38,49.28 0 top
R15  64.4,51.56 180 top
R16  70.87,49.28 180 top
R17  64.4,53.85 180 top
R18  73.53,35.94 180 top
R19  73.53,40.64 0 top
R20  87.51,42.55 180 top
R21  84.96,43.31 270 top
R28  82.68,8.89 180 top
REF-2.1  66.41,27.69 90 top
REF_ADJ  65.53,24.51 180 top
RSENSE  118.11,52.57 270 top
S1  20.07,78.23 180 top
S2  46.62,76.45 270 top
S3  10.8,78.23 180 top
TMP1  50.29,59.69 180 top
TMP2  50.29,57.15 180 top
TMP3  50.29,54.61 180 top
TMP4  50.29,52.07 180 top
U1  31.75,52.07 180 top
U2  93.53,32.26 0 top
U3  70.75,59.18 180 top
U4  109.34,29.34 270 top
U5  70.86,25.78 180 top
U6  70.22,31.24 0 top
U7  67.68,43.18 270 top
U8  87.63,45.33 270 top
VAUX_IN  81.79,0.13 0 top
VAUX_OUT  61.98,80.01 180 top
VBIAS  81.79,35.93 0 top
VCTL  77.72,80.01 180 top
VGATE  89.92,41.15 270 top
VI  93.47,80.01 180 top
VREF  109.22,80.01 180 top
VTEMP  65.53,31.62 90 top

### Tracks (layer width: path | path; a pad name or v marks a point on that pad's centre or on a via)
+5V  (via drill 0.6)
  Top 0.61: C4.1 34.04,59.34 v34.04,60.83 | v34.8,57.53 33.88,57.53 C3.1 33.66,57.26 U1.1
  pour Route15 (isolate 0.635, no thermals): 35.31,68.71 0.13,68.71 0,48.01 30.35,48.01 30.35,50.8 35.31,50.8
+12V  (via drill 0.33, 0.9)  (4 unrouted)
  Top 0.254: v2.54,76.71 R9.2 | R3.1 65,61.85 v63.88,61.85 | 75.69,26.8 75.82,26.67
  Top 0.305: D2.C v72.77,53.85
  Top 0.406: U5.3 73.45,26.44 C17.1
  Top 0.61: U2.2 93.53,26.61 v93.47,26.67 | R5.2 88.27,31.11 v88.65,31.5 | v93.98,34.29 93.98,34.35 U2.4 | v67.31,57.28 C6.1 67.39,58.24 U3.5 | v85.34,46.35 86.46,46.35 U8.1 | C15.1 73.83,26.82 C17.1 73.55,26.54 | C14.1 74.72,32.28 C16.1 74.01,31.57 U6.7 | v75.69,27.94 75.69,26.8 | v77.09,26.92 75.82,26.92 | v73.66,27.69 73.66,26.67 | v76.58,33.4 76.58,32.26 v77.98,32.26 | v62.48,42.16 C20.1 63.63,43.18 U7.4 | v58.67,43.31 59.94,43.31 | C22.1 59.94,43.27 v59.94,42.16 | v74.55,33.15 74.55,32.13
  Top 0.813: C11.+ v41.27,13.84
  Top 1.016: v36.58,7.75 C9.+ | C10.+ v46.99,7.62 | 36.58,5.71 C9.+ | C9.+ | v47.88,46.99 L2.2 | D1.A 99.56,31.76 98.93,32.38 96.27,32.38 96.14,32.51 96.14,32.64 v96.52,33.02
  other vias: 98.68,57.4 101.22,63.75 99.95,63.75 98.68,63.75 97.41,63.75 96.14,63.75 94.87,63.75 93.6,63.75 92.33,63.75 91.06,63.75 89.79,63.75 88.52,63.75 87.25,63.75 85.98,63.75 101.22,62.48 99.95,62.48 98.68,62.48 97.41,62.48 96.14,62.48 94.87,62.48 93.6,62.48 92.33,62.48 91.06,62.48 89.79,62.48 88.52,62.48 87.25,62.48 85.98,62.48 85.98,61.21 85.98,59.94 85.98,58.67 85.98,57.4 85.98,56.13 87.25,61.21 88.52,61.21 89.79,61.21 91.06,61.21 92.33,61.21 93.6,61.21 94.87,61.21 96.14,61.21 97.41,61.21 98.68,61.21 99.95,61.21 101.22,61.21 101.22,59.94 99.95,59.94 98.68,59.94 97.41,59.94 96.14,59.94 94.87,59.94 93.6,59.94 92.33,59.94 91.06,59.94 89.79,59.94 88.52,59.94 87.25,59.94 87.25,58.67 88.52,58.67 89.79,58.67 90.17,31.75 90.17,33.02 90.17,34.29 90.17,35.56 90.17,36.83 90.17,38.1 91.44,38.1 91.44,36.83 91.44,35.56 91.44,34.29 91.44,33.02 91.44,31.75 92.71,31.75 92.71,33.02 92.71,34.29 92.71,35.56 92.71,36.83 92.71,38.1 93.98,38.1 93.98,36.83 93.98,35.56 93.98,33.02 93.98,31.75 95.25,31.75 95.25,33.02 95.25,34.29 95.25,35.56 95.25,36.83 95.25,38.1 96.52,38.1 96.52,36.83 96.52,35.56 96.52,34.29 96.52,31.75 97.79,31.75 97.79,33.02 97.79,34.29 97.79,35.56 97.79,36.83 97.79,38.1 88.9,38.1 88.9,36.83 88.9,35.56 88.9,34.29 88.9,33.02 88.9,39.37 90.17,39.37 91.44,39.37 92.71,39.37 93.98,39.37 95.25,39.37 96.52,39.37 97.79,39.37 101.22,65.02 99.95,65.02 98.68,65.02 97.41,65.02 96.14,65.02 94.87,65.02 93.6,65.02 92.33,65.02 91.06,65.02 89.79,65.02 88.52,65.02 87.25,65.02 85.98,65.02 91.06,58.67 92.33,58.67 93.6,58.67 94.87,58.67 96.14,58.67 97.41,58.67 98.68,58.67 99.95,58.67 101.22,58.67 101.22,57.4 99.95,57.4 97.41,57.4 96.14,57.4 94.87,57.4 93.6,57.4 92.33,57.4 91.06,57.4 89.79,57.4 88.52,57.4 87.25,57.4 87.25,56.13 88.52,56.13 89.79,56.13 91.06,56.13 92.33,56.13 93.6,56.13 94.87,56.13 96.14,56.13 97.41,56.13 98.68,56.13 99.95,56.13 101.22,56.13 101.22,54.86 99.95,54.86 98.68,54.86 97.41,54.86 96.14,54.86 94.87,54.86 93.6,54.86 92.33,54.86 91.06,54.86 89.79,54.86 88.52,54.86 87.25,54.86 85.98,54.86 85.98,53.59 87.25,53.59 88.52,53.59 89.79,53.59 91.06,53.59 92.33,53.59 93.6,53.59 94.87,53.59 96.14,53.59 97.41,53.59 98.68,53.59 99.95,53.59 101.22,53.59 101.22,52.32 99.95,52.32 98.68,52.32 97.41,52.32 96.14,52.32 94.87,52.32 93.6,52.32 92.33,52.32 91.06,52.32 89.79,52.32 88.52,52.32 87.25,52.32 85.98,52.32 85.98,51.05 87.25,51.05 88.52,51.05 89.79,51.05 91.06,51.05 92.33,51.05 93.6,51.05 94.87,51.05 96.14,51.05 97.41,51.05 98.68,51.05 99.95,51.05 101.22,51.05 101.22,49.78 99.95,49.78 98.68,49.78 97.41,49.78 96.14,49.78 94.87,49.78 93.6,49.78 92.33,49.78 91.06,49.78 89.79,49.78 88.52,49.78 87.25,49.78 85.98,49.78 85.98,48.51 87.25,48.51 88.52,48.51 89.79,48.51 91.06,48.51 92.33,48.51 93.6,48.51 94.87,48.51 96.14,48.51 97.41,48.51 98.68,48.51 99.95,48.51 101.22,48.51 87.63,76.96 84.71,65.02 83.44,65.02 83.44,63.75 84.71,63.75 84.71,62.48 83.44,62.48 83.44,61.21 84.71,61.21 84.71,59.94 83.44,59.94 83.44,58.67 84.71,58.67 84.71,57.4 83.44,57.4 83.44,56.13 83.44,54.86 83.44,53.59 83.44,52.32 83.44,51.05 83.44,49.78 83.44,48.51 84.71,48.51 84.71,49.78 84.71,51.05 84.71,52.32 84.71,53.59 84.71,54.86 84.71,56.13 102.49,48.51 103.76,48.51 105.03,48.51 106.3,48.51 106.3,49.78 105.03,49.78 103.76,49.78 102.49,49.78 102.49,51.05 103.76,51.05 105.03,51.05 106.3,51.05 106.3,52.32 105.03,52.32 103.76,52.32 102.49,52.32 102.49,53.59 103.76,53.59 105.03,53.59 106.3,53.59 106.3,54.86 105.03,54.86 103.76,54.86 102.49,54.86 102.49,56.13 103.76,56.13 105.03,56.13 106.3,56.13 106.3,57.4 105.03,57.4 103.76,57.4 102.49,57.4 102.49,58.67 103.76,58.67 105.03,58.67 106.3,58.67 106.3,59.94 105.03,59.94 103.76,59.94 102.49,59.94 102.49,61.21 103.76,61.21 105.03,61.21 106.3,61.21 106.3,62.48 103.76,62.48 102.49,62.48 105.03,62.48 102.49,63.75 102.49,65.02 103.76,65.02 103.76,63.75 105.03,63.75 105.03,65.02 106.3,65.02 106.3,63.75
  pour Bottom (rank 2, no thermals): 62.99,68.07 108.71,68.07 108.71,22.35 62.99,22.35
  pour Top: 107.57,47.24 82.17,47.24 82.17,66.29 107.57,66.29
  pour Route15 (rank 3, no thermals): 0,80.01 124.97,80.01 124.97,0 0,0 0,47.5 30.86,47.5 30.86,50.29 35.81,50.29 35.81,69.22 0,69.22
+15V  (1 unrouted)
  Top 1.016: 96.14,22.86 96.14,25 U2.3
  Top 1.27: C7.+ 93.09,21.46 94.74,19.81
  Top 1.676: PWR_DIST.1 PWR_DIST.2 74.3,18.29 74.68,18.67 | PWR_DIST.3 PWR_DIST.4 76.83,18.54 76.71,18.67
  Top 2.54: 96.14,22.86 96.14,21.21 94.74,19.81 93.6,18.67 76.71,18.67 74.68,18.67 62.36,18.67 59.82,16.13 PWR_IN.1
  pour Route15 (no thermals): 122.43,20.07 122.43,24.89 111.76,24.89 105.92,19.05 105.92,8.13 110.49,8.13 110.74,8.13 110.74,12.7 111,12.95 114.81,12.95 116.33,14.48 116.33,19.81 122.43,19.81
-2.1V  (via drill 0.33 pad 0.61, 0.6 pad 0.61)
  Top 0.406: U7.11 73.03,43.18 C21.1
  Top 0.61: R11.1 103.38,27.81 104.14,27.05 106.27,27.05 | 106.93,27.05 106.27,27.05 | 106.27,27.05 U4.3 106.24,24.51 C13.- v106.43,22.48 | v76.96,43.31 76.96,43.28 C23.1 73.03,43.28 C21.1
  Bottom 0.61: v76.96,43.31 78.54,43.31 79.12,42.72 79.12,23.06 79.7,22.48 v106.43,22.48
-6V  (via drill 0.33)
  Top 1.27: LED_PD.6 98.68,9.91 97.03,8.26 91.75,8.26 90.55,9.45 90.55,11.68 | 104.14,22.86 102.36,21.08 101.35,21.08 95.89,15.62 90.55,15.62 90.55,11.68 | PWR_IN.3 70.41,11.68 84.45,11.68 | 84.45,11.68 87,11.68 | 87,11.68 90.55,11.68 | PWR_DIST.12 PWR_DIST.11 87,11.68 | PWR_DIST.9 PWR_DIST.10 84.45,11.68
  other vias: 102.87,25.4 104.14,25.4 104.14,24.13 102.87,24.13 102.87,26.67 107.95,26.67 107.95,27.94 107.95,29.21 107.95,30.48 107.95,31.75 107.95,22.86 107.95,24.13 107.95,25.4
  pour Top (no thermals): 102.23,36.2 102.23,22.35 113.92,22.23 113.92,36.07
_VREF
  Top 0.305: D2.A D3.C 68.06,49.4 | 68.06,49.4 68.06,44.58 | 68.06,44.58 68.06,43.29 66.67,41.91 U7.5 | U7.12 68.18,44.45 arc-90 68.06,44.58 | R16.2 68.18,49.28 68.06,49.4
COMP+
  Top 0.254: U3.3 71.88,60.28 C5.1
  Top 0.305: R2.1 C5.1
CS
  Top 0.254: CS4.2 CS3.2 CS2.2 | 9.91,54.61 CS2.2 | CS2.2 9.65,53.09 | 9.65,53.09 CS1.2 | 9.65,53.09 32,53.09 32.38,53.47 U1.2 32.51,54.66
CS0
  Top 0.254: CS4.1 ARDUNIO.D2
CS1
  Top 0.254: ARDUNIO.D3 CS3.1
CS2
  Top 0.254: CS2.1 ARDUNIO.D4
CS3
  Top 0.254: ARDUNIO.D5 CS1.1
CS4
  Top 0.254: ARDUNIO.A0 TMP4.1
CS5
  Top 0.254: ARDUNIO.A1 TMP3.1
CS6
  Top 0.254: ARDUNIO.A3 TMP1.1
CS8
  Top 0.254: ARDUNIO.A2 TMP2.1
DACA  (via drill 0.33 pad 0.61)
  Top 0.254: 37.85,55.23 R1.2 | 22.48,75.39 S1.1
  Top 0.305: U1.8 36.64,49.47 37.85,50.67 37.85,55.23 | v22.48,73.53 22.48,75.39 | v37.85,56.77 37.85,55.26 R1.2
  Bottom 0.305: v22.48,73.53 37.21,73.53 37.86,72.88 37.86,56.79 v37.85,56.77
GND  (via drill 0.33, 0.6, 0.6 pad 0.61, 0.9)  (3 unrouted)
  Top 0.254: v2.54,78.99 PWR.C | v73.28,59.18 U3.2 | R4.2 v67.31,64.64 | v73.03,63.63 73,63.6 C5.2 | C1.2 v44.2,55.24
  Top 0.305: R14.2 v66.29,49.28 | D3.A v72.77,51.56 | R13.1 65.51,29.69 v65.53,29.72 | Q1.E 76.64,60.77 v76.71,60.58 | C18.2 66.01,55.37 v66.17,55.37 | 68.07,30.12 68.04,30.15 U6.4
  Top 0.406: U5.2 72.89,25.78 73.65,25.02 C17.2
  Top 0.61: C4.2 31.86,59.44 v30.73,59.44 | 31.88,59.44 v31.88,60.83 | v32.38,51.69 U1.7 32.38,47.9 C2.2 | R10.2 v103.38,34.8 | v105.66,34.29 C12.+ | C13.+ v111.38,24.51 | R6.1 v89.41,24.26 | C8.- v80.39,25.15 | C6.2 v66.17,60.07 | v83.82,44.32 85.09,44.3 | 85.09,44.3 R21.1 | 85.09,44.3 86.45,44.3 U8.3 | RSENSE.1 116.73,52.7 v115.57,52.7 | 116.84,53.98 v115.57,53.98 v114.43,53.98 | 116.84,55.24 v115.57,55.24 v114.43,55.24 | 116.84,51.44 v115.57,51.44 v114.43,51.44 | 116.84,50.16 v115.57,50.16 v114.43,50.16 | C15.2 73.83,24.74 C17.2 | C14.2 74.72,30.2 C16.2 | v75.69,23.62 75.69,24.64 v77.09,24.64 | v73.66,23.88 73.66,24.89 | v77.98,30.23 76.58,30.23 | v76.58,29.08 76.58,30.23 | 76.58,30.23 76.58,30.35 | v74.55,29.34 74.55,30.23 | 76.58,30.23 76.33,30.23 | C21.2 v72.77,45.97 | C23.2 v75.18,46.48 | v60.07,46.48 C22.2 | v62.48,45.97 62.48,44.96 | 62.48,44.96 C20.2 | v58.67,45.34 60.07,45.34 60.45,44.96 62.48,44.96 | v68.07,29.46 68.07,30.12 | v30.73,57.66 31.11,57.28 C3.2 | v116.71,56.64 116.71,55.5 | v116.71,48.39 116.71,49.66 | 114.55,52.7 v115.57,52.7 | 114.3,52.7 v115.57,52.7
  Top 0.813: 37.85,11.8 C11.- v37.97,13.84 | C7.- 86.49,21.21 v85.09,21.21
  Top 1.016: C9.- v42.67,7.75 | C10.- v53.09,7.75 | v47.75,44.45 L1.2
  other vias: 75.44,40.64 114.43,52.7
  pour Route2 (rank 3, no thermals): 0,80.01 124.97,80.01 124.97,0 0,0 0,47.5 30.86,47.5 30.86,50.29 35.81,50.29 35.81,69.22 0,69.22
  pour Route2 (isolate 0.635, no thermals): 35.31,68.71 0.13,68.71 0,48.01 30.35,48.01 30.35,50.8 35.31,50.8
  pour Route2 (no thermals): 32,51.31 32,49.78 32.77,49.78 32.77,51.31
  pour Bottom (isolate 0.381, rank 3, no thermals): 0,80.01 124.97,80.01 124.97,0 0,0 0,47.5 30.86,47.5 30.86,50.29 35.81,50.29 35.81,69.22 0,69.22
KEEPOUT
  pour Route2 (isolate 0.381, no thermals): 3.3,47.5 7.11,47.5 7.11,18.8 3.3,18.8
  pour Route15 (isolate 0.381): 3.3,47.5 7.11,47.5 7.11,18.8 3.3,18.8
  pour Route15 (isolate 0.381): 51.56,48.51 55.37,48.51 55.37,27.69 51.56,27.69
  pour Route2 (isolate 0.381): 51.56,48.51 55.37,48.51 55.37,27.69 51.56,27.69
LDAC
  Top 0.254: ARDUNIO.D6 29.79,49.53 U1.5
LED+
  pour Top (no thermals): 114.94,17.53 114.94,41.53 113.67,42.8 95.5,42.8 95.5,46.1 116.2,46.1 118.75,43.56 118.75,18.8 117.47,17.53
  pour Top (no thermals): 100.2,9.65 100.19,18.41 101.73,19.94 108.71,19.94 109.86,21.08 118.75,21.08 118.75,18.81 117.47,17.54 103.5,17.53 102.22,16.27 102.23,9.65
LED-
  Top 0.406: RSENSE.2 119.25,52.68 119.25,65.66 117.73,67.18 80.14,67.18 79.12,66.17 79.12,42.93 78.11,41.91 U7.10
  Top 0.61: 119.36,53.95 RSENSE.2
  pour Top (no thermals): 120.14,12.06 120.14,49.28 118.75,49.28 118.75,56.26 121.41,56.26 123.95,53.71 123.95,13.34 122.68,12.06
  pour Top (no thermals): 102.74,9.65 102.74,14.35 108.71,14.35 109.86,15.49 arc-1 123.95,15.49 123.95,13.33 122.69,11.93 105.92,11.94 104.65,10.67 104.65,9.65
N$1
  Top 0.254: R1.1 C1.1
N$2
  Top 0.305: OC.A R8.1
N$3
  Top 0.254: PWR.A R9.1
N$4
  Top 0.305: U7.7 65.08,35.05 65.97,34.16 80.9,34.16 81.79,35.05 VBIAS.TP 81.79,43.94 83.19,45.33 U8.2
  Top 0.406: U8.5 U8.2 87.62,45.33 87.63,45.34
N$5
  Top 0.254: R3.2 66.75,61.87 R4.1 | 69.93,60.12 U3.4
  Top 0.305: 67.7,61.87 R4.1 67.31,61.8 68.98,60.12 U3.4
N$6
  Top 0.305: R13.2 REF_ADJ.3
N$7  (via drill 0.33 pad 0.61)
  Top 0.305: R16.1 72.9,49.28 73.91,50.29 73.91,53.98 72.64,55.24 67.69,55.24 v62.36,60.58 | GAIN.W 32.77,74.42 34.54,72.64 37.47,72.64 41.27,76.45 46.99,76.45 v51.31,72.14
  Bottom 0.305: v51.31,72.14 51.31,68.83 53.09,67.06 55.88,67.06 v62.36,60.58
N$8
  Top 0.305: R15.2 63.53,49.29 R14.1 63.5,49.26 63.5,46.1 63.88,45.72 U7.2
N$9
  Top 0.305: Q1.C 75.69,68.33 76.71,69.34 95,69.34 96.01,70.36 96.01,78.11 95.12,78.99 86.58,78.99 OC.C
N$10
  Top 0.406: U8.6 89.48,46.28 89.66,46.1 89.66,44.58 89.53,44.45 88.8,44.45 U8.4 88.37,44.03 R20.1
N$11
  Top 1.016: ARDUNIO.GND2 L1.1
N$12
  Top 0.61: R11.2 R10.1 105.99,31.9 U4.1
N$13  (1 unrouted)
  Top 0.305: R20.2 88.04,41.15 VGATE.TP 91.06,42.29 Q2.G
  Top 0.61: R20.2 85.06,42.55 R21.2
N$14
  Top 1.016: ARDUNIO.VIN L2.1
N$15
  Top 0.305: 72.53,40.77 R19.1 | R19.1 72.66,40.08 C19.2 R18.1 | U7.9 R19.1
N$20
  Top 0.305: R12.2 69.82,24.51 U5.5
N$22
  Top 0.305: R12.1 69.43,23.06 REF_ADJ.2
N$27
  Top 0.305: U3.1 74.73,58.24 R7.2
N$28
  Top 0.305: R7.1 74.81,61.83 Q1.B
N$31
  Top 0.61: 60.07,43.31 62.61,43.31
N$72
  Top 0.61: R5.1 R6.2 | R6.2 88.28,26.04 89.28,26.04 90.25,25.07 U2.1 91.06,25 | C8.+ 86.23,25.15 87.12,26.04 88.25,26.04 R6.2
REFA  (via drill 0.6 pad 0.3)
  Top 0.305: 67.28,26.44 REF_ADJ.1 66.8,27.3 REF-2.1.TP
  Top 0.61: U1.6 31.47,49.11 C2.1 31.47,24.89 32.49,23.88 v43.05,23.88 | U5.4 67.28,26.44 | v66.93,44.45 U7.3 | REF_ADJ.1 66.8,25.77 65.53,24.51 v61.09,24.51
  Bottom 0.61: v43.05,23.88 60.45,23.88 60.77,24.19 v61.09,24.51 61.47,24.89 61.47,43.43 62.48,44.45 v66.93,44.45
REFA2X  (via drill 0.33 pad 0.61)
  Top 0.305: R17.2 63.53,55.99 C18.1 63.5,56.15 | S2.1 49.57,72.6 v50.04,72.14 | v62.36,59.18 63.5,58.04 63.5,56.15 | 63.5,56.01 63.5,56.15
  Bottom 0.305: v50.04,72.14 50.04,68.83 52.58,66.29 55.24,66.29 v62.36,59.18
SCLK
  Top 0.254: ARDUNIO.SCK 27.94,64.78 27.94,59.18 31.11,56.01 U1.3
SDI
  Top 0.254: U1.4 29.96,54.62 | ARDUNIO.MOSI 27.69,67.44 26.8,66.55 26.8,59.44 29.84,56.39 U1.4 | 29.66,54.67 U1.4
TEMP
  Top 0.305: 67.99,30.86 U6.3 69.16,30.91 70.87,29.21 70.87,25.4 71.14,25.12 U5.1
VAUX  (via drill 0.33 pad 0.61)  (1 unrouted)
  Top 0.254: VAUX_OUT.1 61.98,73.28
  Top 0.305: S3.3 8.3,71.25 10.08,69.47 44.45,69.47 45.72,68.2 45.72,52.2 44.7,51.18 44.7,18.41 52.2,10.92 68.2,10.92 70.23,8.89 R28.2 81.81,4.98 VAUX_IN.1 | v61.98,71.75 61.98,73.28
  Bottom 0.305: v53.09,68.71 61.21,68.71 61.98,69.47 v61.98,71.75
VCTL
  Top 0.305: GAIN.A 29.01,73.91 30.79,72.14 41.27,72.14 43.18,74.04 45.34,74.04 45.97,73.41 S2.2
VCTL_PRE
  Top 0.305: S1.2 20.07,73.41 21.84,71.63 42.46,71.63 S2.3
VFB
  Top 0.305: S3.2 10.8,71.88 12.58,70.1 54.86,70.1 56.9,68.07 56.9,42.04 58.29,40.64 U7.6
VI  (via drill 0.33 pad 0.61)
  Top 0.305: S3.1 13.3,72.39 15.08,70.61 61.09,70.61 61.34,70.36 62.74,70.36 62.99,70.61 69.72,70.61 | 69.72,70.61 92.02,70.61 93.47,72.06 VI.1 | 69.72,70.61 69.6,70.48 R2.2 69.49,63.5 68.83,63.5 68.45,63.12 68.45,61.37 68.99,60.83 70.48,60.83 70.74,60.58 70.74,57.4 v71.37,56.77 | U7.8 70.23,39.32 70.23,38.86 70.74,38.35 C19.1 R18.2 72.64,35.92 72.64,35.69 73.66,34.67 79.12,34.67 80.14,35.69 v80.14,55.75
  Bottom 0.305: v71.37,56.77 79.12,56.77 v80.14,55.75
VINPUT
  Top 0.305: VCTL.1 77.72,71.63 77.22,71.12 62.74,71.12 62.48,70.87 61.59,70.87 61.34,71.12 19.34,71.12 17.57,72.9 S1.3
VPD  (via drill 0.33)
  Top 0.305: v81.79,10.16 81.79,8.89
  Bottom 0.305: LED_PD.9 90.42,10.16 v81.79,10.16
VREF
  Top 0.305: VREF.1 109.22,71.94 105.61,68.33 79.25,68.33 78.23,67.31 78.23,48.51 77.22,47.5 70.79,47.5 U7.14 U7.13
VREFA2X
  Top 0.305: R15.1 65.28,51.56 | R15.1 R17.1 | U7.1 66.55,46.99 67.18,47.62 67.18,50.8 66.29,51.69 65.39,51.69 R15.1
VTEMP
  Top 0.305: U6.6 70.05,30.91 69.39,31.57 U6.2 67.99,31.62 VTEMP.TP 62.48,31.62 58.42,27.56 46.61,27.56 45.59,28.57 45.59,51.05 46.61,52.07 TMP4.2 TMP3.2 TMP2.2 TMP1.2